# EAGLE design MOTOR_DRIVER (EAGLE 8.0.1)

## Sheet 1 of 4: Motor Driver Schematic
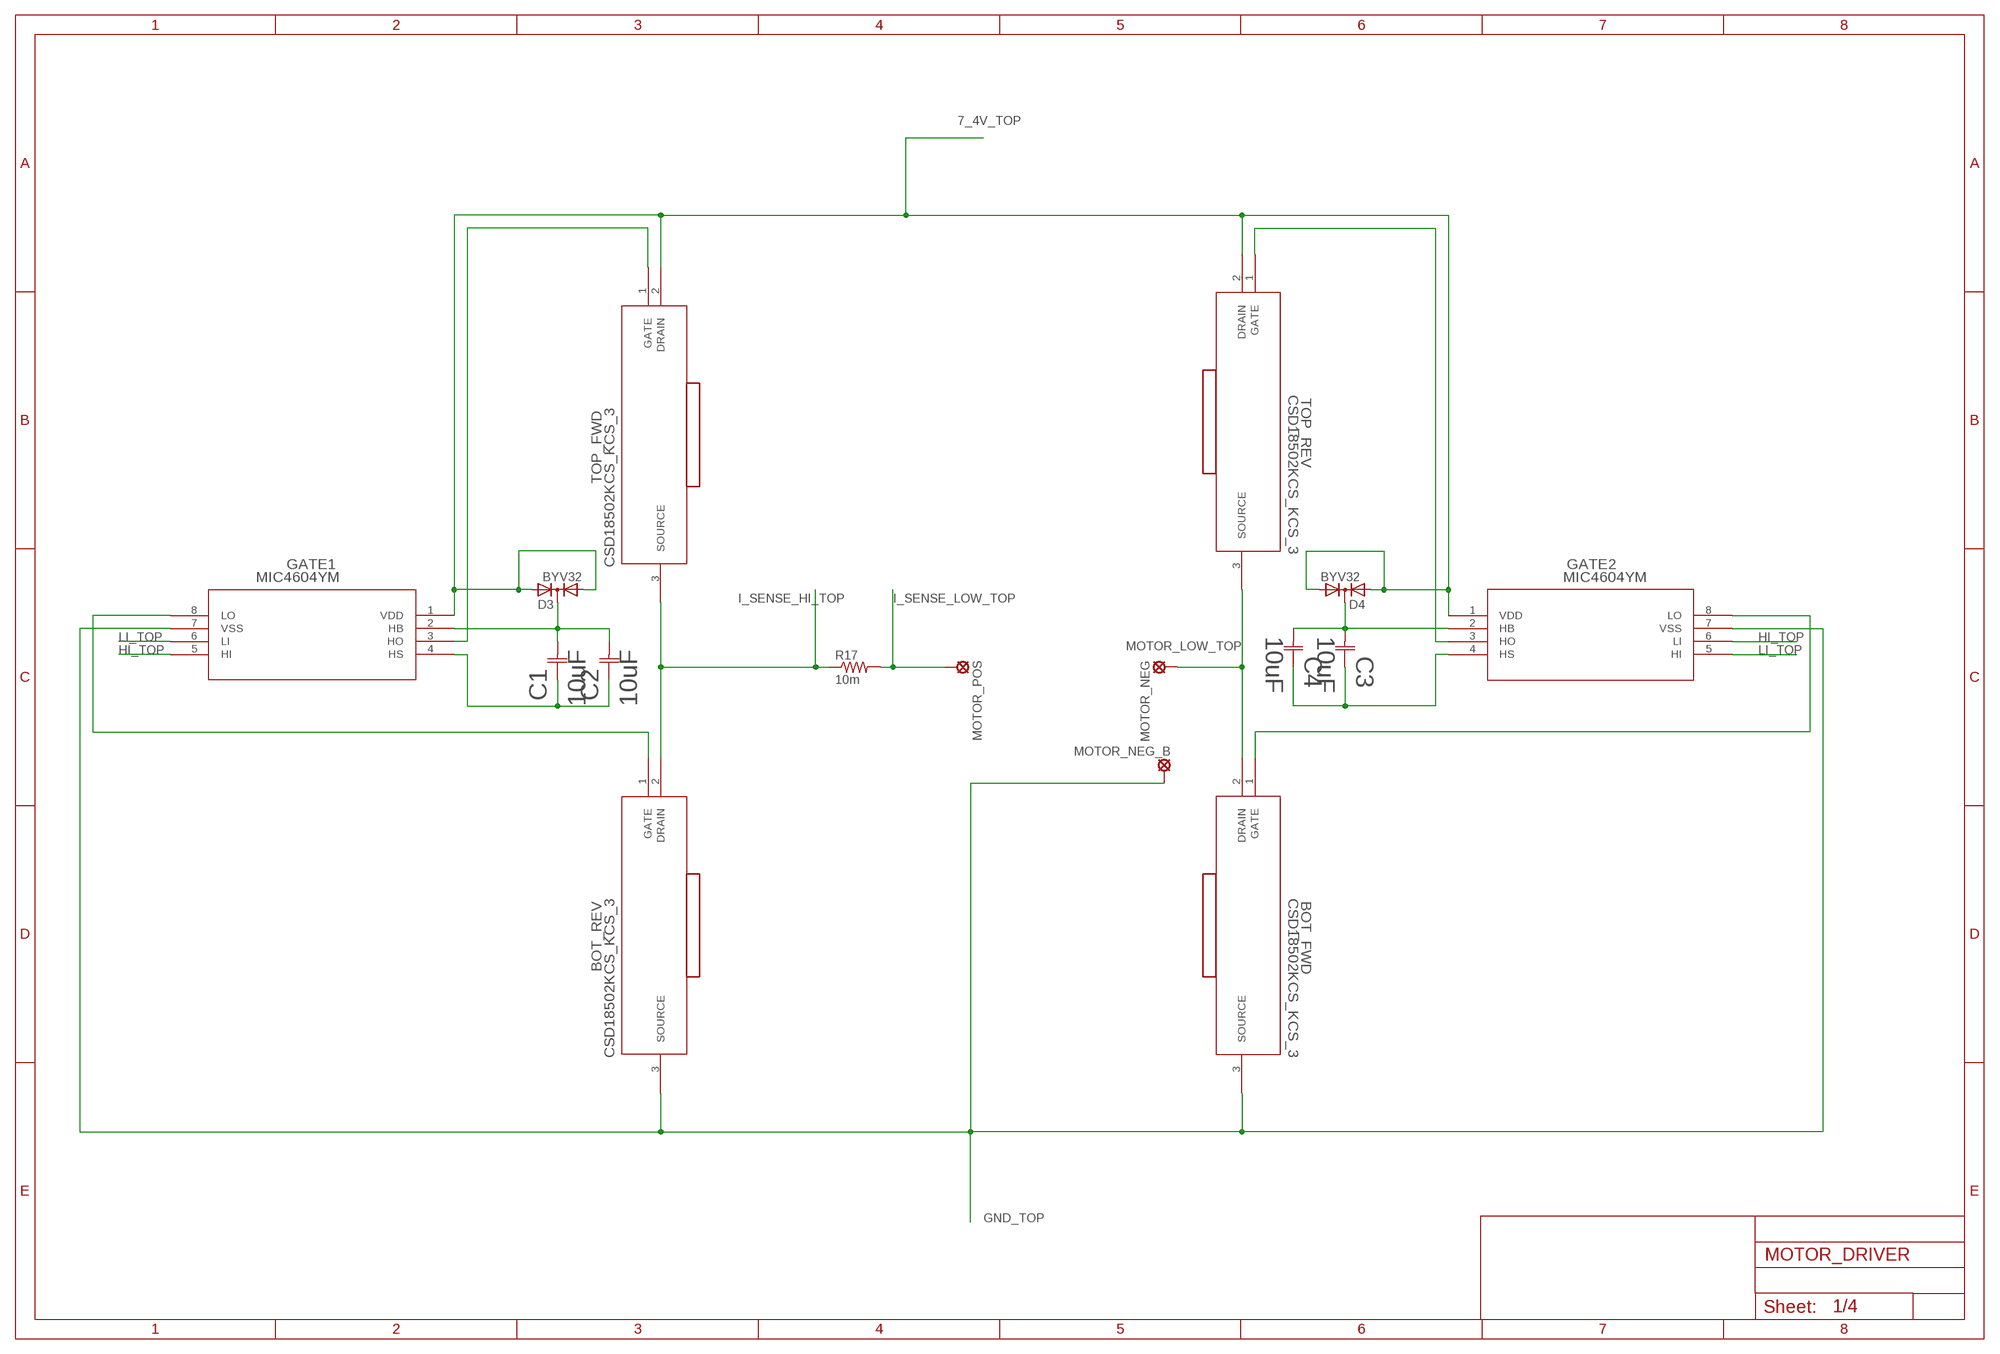
[diagram p0: schematic, sheet 1]

### Parts
BOT_FWD  CSD18502KCS_KCS_3  [KCS3]
BOT_REV  CSD18502KCS_KCS_3  [KCS3]
C1  10uF  EEE1VA100WR  [CAP_EEE_B]
C2  10uF  EEE1VA100WR  [CAP_EEE_B]
C3  10uF  EEE1VA100WR  [CAP_EEE_B]
C4  10uF  EEE1VA100WR  [CAP_EEE_B]
D3  BYV32  [TO220ABS]
D4  BYV32  [TO220ABS]
GATE1  MIC4604YM  [SOIC-8_M]
GATE2  MIC4604YM  [SOIC-8_M]
MOTOR_NEG  SE14  [SE14]
MOTOR_NEG_B  SE14  [SE14]
MOTOR_POS  SE14  [SE14]
R17  10m  R-US_R2512  [R2512]
TOP_FWD  CSD18502KCS_KCS_3  [KCS3]
TOP_REV  CSD18502KCS_KCS_3  [KCS3]
U$2  HEATSINK  [HEATSINK]
U$4  HEATSINK  [HEATSINK]
U$5  HEATSINK  [HEATSINK]
U$6  HEATSINK  [HEATSINK]

### Nets
7_4V_TOP: D3.A1 D3.A2 D4.A1 D4.A2 GATE1.1(VDD) GATE2.1(VDD) TOP_FWD.2(DRAIN) TOP_REV.2(DRAIN) ; also sheet 2,3,4
GND_TOP: BOT_FWD.3(SOURCE) BOT_REV.3(SOURCE) GATE1.7(VSS) GATE2.7(VSS) MOTOR_NEG_B.MP ; also sheet 2,3,4
HI_TOP: GATE1.5(HI) GATE2.6(LI) ; also sheet 3
I_SENSE_HI_TOP: BOT_REV.2(DRAIN) R17.1 TOP_FWD.3(SOURCE) ; also sheet 2
I_SENSE_LOW_TOP: MOTOR_POS.MP R17.2 ; also sheet 2,3
LI_TOP: GATE1.6(LI) GATE2.5(HI) ; also sheet 3
MOTOR_LOW_TOP: BOT_FWD.2(DRAIN) MOTOR_NEG.MP TOP_REV.3(SOURCE) ; also sheet 3
N$2: BOT_REV.1(GATE) GATE1.8(LO)
N$3: GATE1.3(HO) TOP_FWD.1(GATE)
N$4: C1.1 C2.1 GATE1.4(HS)
N$5: C1.2 C2.2 D3.C GATE1.2(HB)
N$9: BOT_FWD.1(GATE) GATE2.8(LO)
N$10: GATE2.3(HO) TOP_REV.1(GATE)
N$11: C3.1 C4.1 GATE2.4(HS)
N$12: C3.2 C4.2 D4.C GATE2.2(HB)

## Sheet 2 of 4: Microcontroller schematic
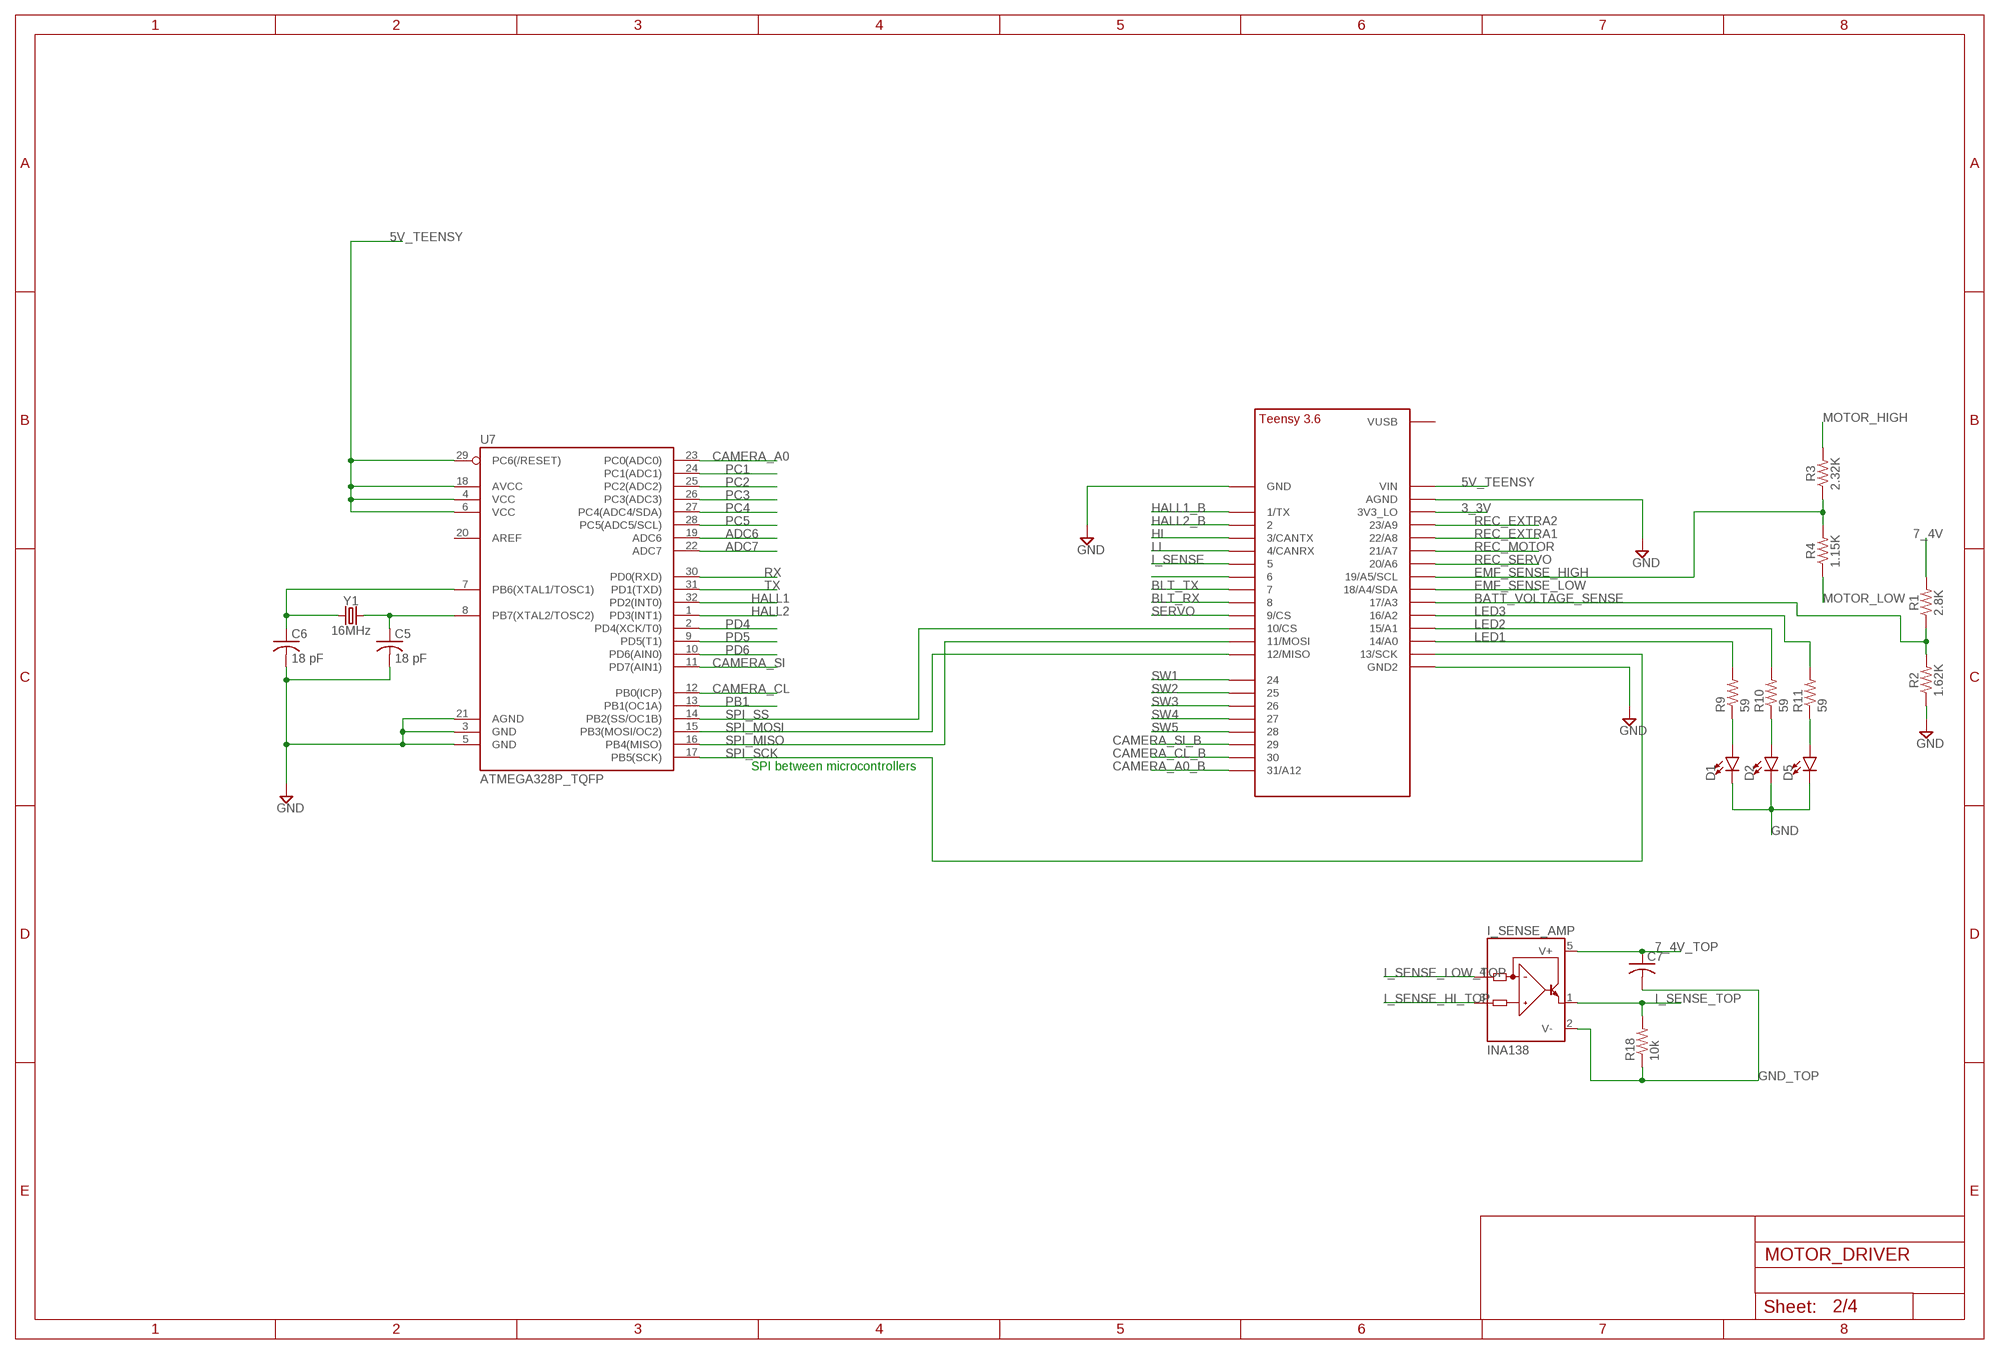
[diagram p1: schematic, sheet 2]

### Parts
C5  18 pF  C-USC0603  [C0603]
C6  18 pF  C-USC0603  [C0603]
C7  C-USC0603  [C0603]
D1  LED0603  [LED-0603]
D2  LED0603  [LED-0603]
D5  LED0603  [LED-0603]
I_SENSE_AMP  INA138  [SOT23-5]
R1  2.8K  0.3OHM-0805-1/8W-1%  [0805]
R2  1.62K  0.3OHM-0805-1/8W-1%  [0805]
R3  2.32K  0.3OHM-0805-1/8W-1%  [0805]
R4  1.15K  0.3OHM-0805-1/8W-1%  [0805]
R9  59  R-US_R0805  [R0805]
R10  59  R-US_R0805  [R0805]
R11  59  R-US_R0805  [R0805]
R18  10k  R-US_R0603  [R0603]
U7  ATMEGA328P_TQFP  [TQFP32-08]
U$1  TEENSY_3.5/3.6_FEWER  [TEENSY_3.5/3.6_BASIC_FEWER_PIN]
Y1  16MHz  CRYSTAL-16MHZPTH-HC49US  [HC49US]

### Nets
3_3V: U$1.3V3_LO ; also sheet 3
5V_TEENSY: U7.4(VCC) U7.6(VCC) U7.18(AVCC) U7.29(PC6(/RESET)) U$1.VIN ; also sheet 3
7_4V: R1.2 ; also sheet 3,4
7_4V_TOP: C7.1 I_SENSE_AMP.5(V+) ; also sheet 1,3,4
ADC6: U7.19(ADC6) ; also sheet 3
ADC7: U7.22(ADC7) ; also sheet 3
BATT_VOLTAGE_SENSE: R1.1 R2.2 U$1.17/A3
BLT_RX: U$1.8 ; also sheet 3
BLT_TX: U$1.7 ; also sheet 3
CAMERA_A0: U7.23(PC0(ADC0)) ; also sheet 3
CAMERA_A0_B: U$1.31/A12 ; also sheet 3
CAMERA_CL: U7.12(PB0(ICP)) ; also sheet 3
CAMERA_CL_B: U$1.30 ; also sheet 3
CAMERA_SI: U7.11(PD7(AIN1)) ; also sheet 3
CAMERA_SI_B: U$1.29 ; also sheet 3
EMF_SENSE_HIGH: R3.1 R4.2 U$1.19/A5/SCL
EMF_SENSE_LOW: U$1.18/A4/SDA ; also sheet 3
GND: C5.2 C6.2 D1.C D2.C D5.C R2.1 U7.3(GND) U7.5(GND) U7.21(AGND) U$1.AGND U$1.GND U$1.GND2 ; also sheet 3,4
GND_TOP: C7.2 I_SENSE_AMP.2(V-) R18.1 ; also sheet 1,3,4
HALL1: U7.32(PD2(INT0)) ; also sheet 3
HALL1_B: U$1.1/TX ; also sheet 3
HALL2: U7.1(PD3(INT1)) ; also sheet 3
HALL2_B: U$1.2 ; also sheet 3
HI: U$1.3/CANTX ; also sheet 3
I_SENSE: U$1.5 ; also sheet 3
I_SENSE_HI_TOP: I_SENSE_AMP.3(IN+) ; also sheet 1
I_SENSE_LOW_TOP: I_SENSE_AMP.4(IN-) ; also sheet 1,3
I_SENSE_TOP: I_SENSE_AMP.1(OUT) R18.2 ; also sheet 3
LED1: R9.2 U$1.14/A0
LED2: R10.2 U$1.15/A1
LED3: R11.2 U$1.16/A2
LI: U$1.4/CANRX ; also sheet 3
LI2: U$1.6
MOTOR_HIGH: R3.2 ; also sheet 3
MOTOR_LOW: R4.1 ; also sheet 3
N$6: C6.1 U7.7(PB6(XTAL1/TOSC1)) Y1.1
N$7: C5.1 U7.8(PB7(XTAL2/TOSC2)) Y1.2
N$22: D1.A R9.1
N$23: D2.A R10.1
N$24: D5.A R11.1
PB1: U7.13(PB1(OC1A)) ; also sheet 3
PC1: U7.24(PC1(ADC1)) ; also sheet 3
PC2: U7.25(PC2(ADC2)) ; also sheet 3
PC3: U7.26(PC3(ADC3)) ; also sheet 3
PC4: U7.27(PC4(ADC4/SDA)) ; also sheet 3
PC5: U7.28(PC5(ADC5/SCL)) ; also sheet 3
PD4: U7.2(PD4(XCK/T0)) ; also sheet 3
PD5: U7.9(PD5(T1)) ; also sheet 3
PD6: U7.10(PD6(AIN0))
REC_EXTRA1: U$1.22/A8 ; also sheet 3
REC_EXTRA2: U$1.23/A9 ; also sheet 3
REC_MOTOR: U$1.21/A7 ; also sheet 3
REC_SERVO: U$1.20/A6 ; also sheet 3
RX: U7.30(PD0(RXD)) ; also sheet 3
SERVO: U$1.9/CS ; also sheet 3
SPI_MISO: U7.16(PB4(MISO)) U$1.11/MOSI
SPI_MOSI: U7.15(PB3(MOSI/OC2)) U$1.12/MISO
SPI_SCK: U7.17(PB5(SCK)) U$1.13/SCK
SPI_SS: U7.14(PB2(SS/OC1B)) U$1.10/CS
SW1: U$1.24 ; also sheet 3
SW2: U$1.25 ; also sheet 3
SW3: U$1.26 ; also sheet 3
SW4: U$1.27 ; also sheet 3
SW5: U$1.28
TX: U7.31(PD1(TXD)) ; also sheet 3
Unconnected: U7.20(AREF) U$1.VUSB

### Notes on the sheet
- SPI between microcontrollers

## Sheet 3 of 4: Header schematic
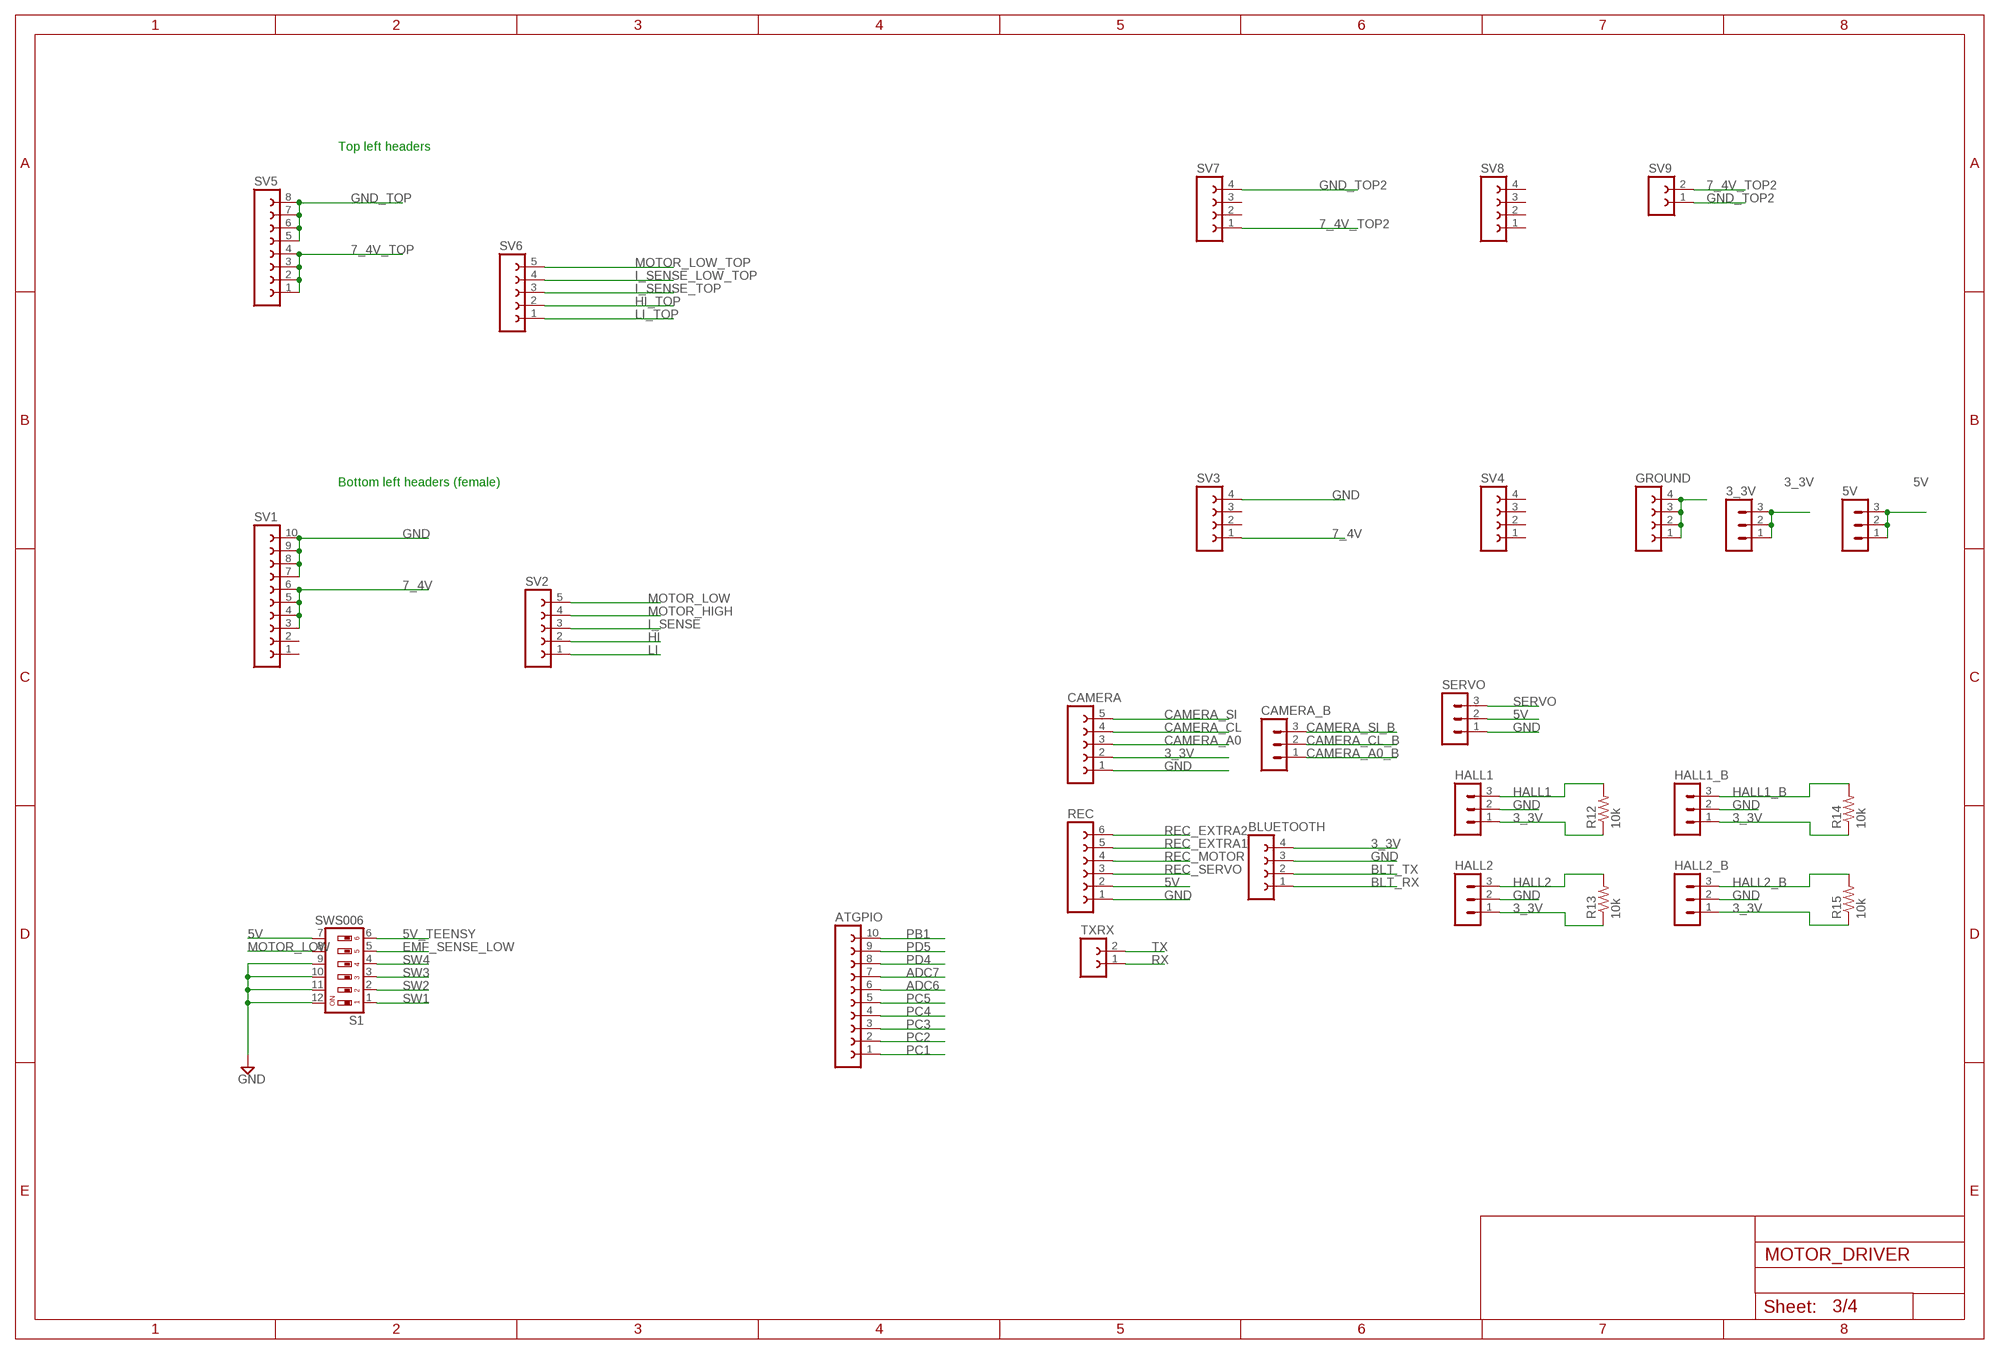
[diagram p2: schematic, sheet 3]

### Parts
3_3V  MA03-1  [MA03-1]
5V  MA03-1  [MA03-1]
ATGPIO  FE10-1  [FE10]
BLUETOOTH  FE04-1  [FE04-1]
CAMERA  FE05-1  [FE05-1]
CAMERA_B  MA03-1  [MA03-1]
GROUND  FE04-1  [FE04-1]
HALL1  MA03-1  [MA03-1]
HALL1_B  MA03-1  [MA03-1]
HALL2  MA03-1  [MA03-1]
HALL2_B  MA03-1  [MA03-1]
R12  10k  R-US_R0603  [R0603]
R13  10k  R-US_R0603  [R0603]
R14  10k  R-US_R0603  [R0603]
R15  10k  R-US_R0603  [R0603]
REC  FE06-1  [FE06]
S1  SWS006  [SMS-006]
SERVO  MA03-1  [MA03-1]
SV1  FE10-1  [FE10]
SV2  FE05-1  [FE05-1]
SV3  FE04-1  [FE04-1]
SV4  FE04-1  [FE04-1]
SV5  FE08-1  [FE08]
SV6  FE05-1  [FE05-1]
SV7  FE04-1  [FE04-1]
SV8  FE04-1  [FE04-1]
SV9  FE02-1  [FE02-1]
TXRX  FE02-1  [FE02-1]

### Nets
3_3V: 3_3V.1 3_3V.2 3_3V.3 BLUETOOTH.4 CAMERA.2 HALL1.1 HALL1_B.1 HALL2.1 HALL2_B.1 R12.1 R13.1 R14.1 R15.1 ; also sheet 2
5V: 5V.1 5V.2 5V.3 REC.2 S1.7 SERVO.2 ; also sheet 4
5V_TEENSY: S1.6 ; also sheet 2
7_4V: SV1.3 SV1.4 SV1.5 SV1.6 SV3.1 ; also sheet 2,4
7_4V_TOP: SV5.1 SV5.2 SV5.3 SV5.4 ; also sheet 1,2,4
7_4V_TOP2: SV7.1 SV9.2 ; also sheet 4
ADC6: ATGPIO.6 ; also sheet 2
ADC7: ATGPIO.7 ; also sheet 2
BLT_RX: BLUETOOTH.1 ; also sheet 2
BLT_TX: BLUETOOTH.2 ; also sheet 2
CAMERA_A0: CAMERA.3 ; also sheet 2
CAMERA_A0_B: CAMERA_B.1 ; also sheet 2
CAMERA_CL: CAMERA.4 ; also sheet 2
CAMERA_CL_B: CAMERA_B.2 ; also sheet 2
CAMERA_SI: CAMERA.5 ; also sheet 2
CAMERA_SI_B: CAMERA_B.3 ; also sheet 2
EMF_SENSE_LOW: S1.5 ; also sheet 2
GND: BLUETOOTH.3 CAMERA.1 GROUND.1 GROUND.2 GROUND.3 GROUND.4 HALL1.2 HALL1_B.2 HALL2.2 HALL2_B.2 REC.1 S1.9 S1.10 S1.11 S1.12 SERVO.1 SV1.7 SV1.8 SV1.9 SV1.10 SV3.4 ; also sheet 2,4
GND_TOP: SV5.5 SV5.6 SV5.7 SV5.8 ; also sheet 1,2,4
GND_TOP2: SV7.4 SV9.1 ; also sheet 4
HALL1: HALL1.3 R12.2 ; also sheet 2
HALL1_B: HALL1_B.3 R14.2 ; also sheet 2
HALL2: HALL2.3 R13.2 ; also sheet 2
HALL2_B: HALL2_B.3 R15.2 ; also sheet 2
HI: SV2.2 ; also sheet 2
HI_TOP: SV6.2 ; also sheet 1
I_SENSE: SV2.3 ; also sheet 2
I_SENSE_LOW_TOP: SV6.4 ; also sheet 1,2
I_SENSE_TOP: SV6.3 ; also sheet 2
LI: SV2.1 ; also sheet 2
LI_TOP: SV6.1 ; also sheet 1
MOTOR_HIGH: SV2.4 ; also sheet 2
MOTOR_LOW: S1.8 SV2.5 ; also sheet 2
MOTOR_LOW_TOP: SV6.5 ; also sheet 1
PB1: ATGPIO.10 ; also sheet 2
PC1: ATGPIO.1 ; also sheet 2
PC2: ATGPIO.2 ; also sheet 2
PC3: ATGPIO.3 ; also sheet 2
PC4: ATGPIO.4 ; also sheet 2
PC5: ATGPIO.5 ; also sheet 2
PD4: ATGPIO.8 ; also sheet 2
PD5: ATGPIO.9 ; also sheet 2
REC_EXTRA1: REC.5 ; also sheet 2
REC_EXTRA2: REC.6 ; also sheet 2
REC_MOTOR: REC.4 ; also sheet 2
REC_SERVO: REC.3 ; also sheet 2
RX: TXRX.1 ; also sheet 2
SERVO: SERVO.3 ; also sheet 2
SW1: S1.1 ; also sheet 2
SW2: S1.2 ; also sheet 2
SW3: S1.3 ; also sheet 2
SW4: S1.4 ; also sheet 2
TX: TXRX.2 ; also sheet 2
Unconnected: SV1.1 SV1.2 SV3.2 SV3.3 SV4.1 SV4.2 SV4.3 SV4.4 SV7.2 SV7.3 SV8.1 SV8.2 SV8.3 SV8.4

### Notes on the sheet
- Top left headers
- Bottom left headers (female)

## Sheet 4 of 4: Power Schematic
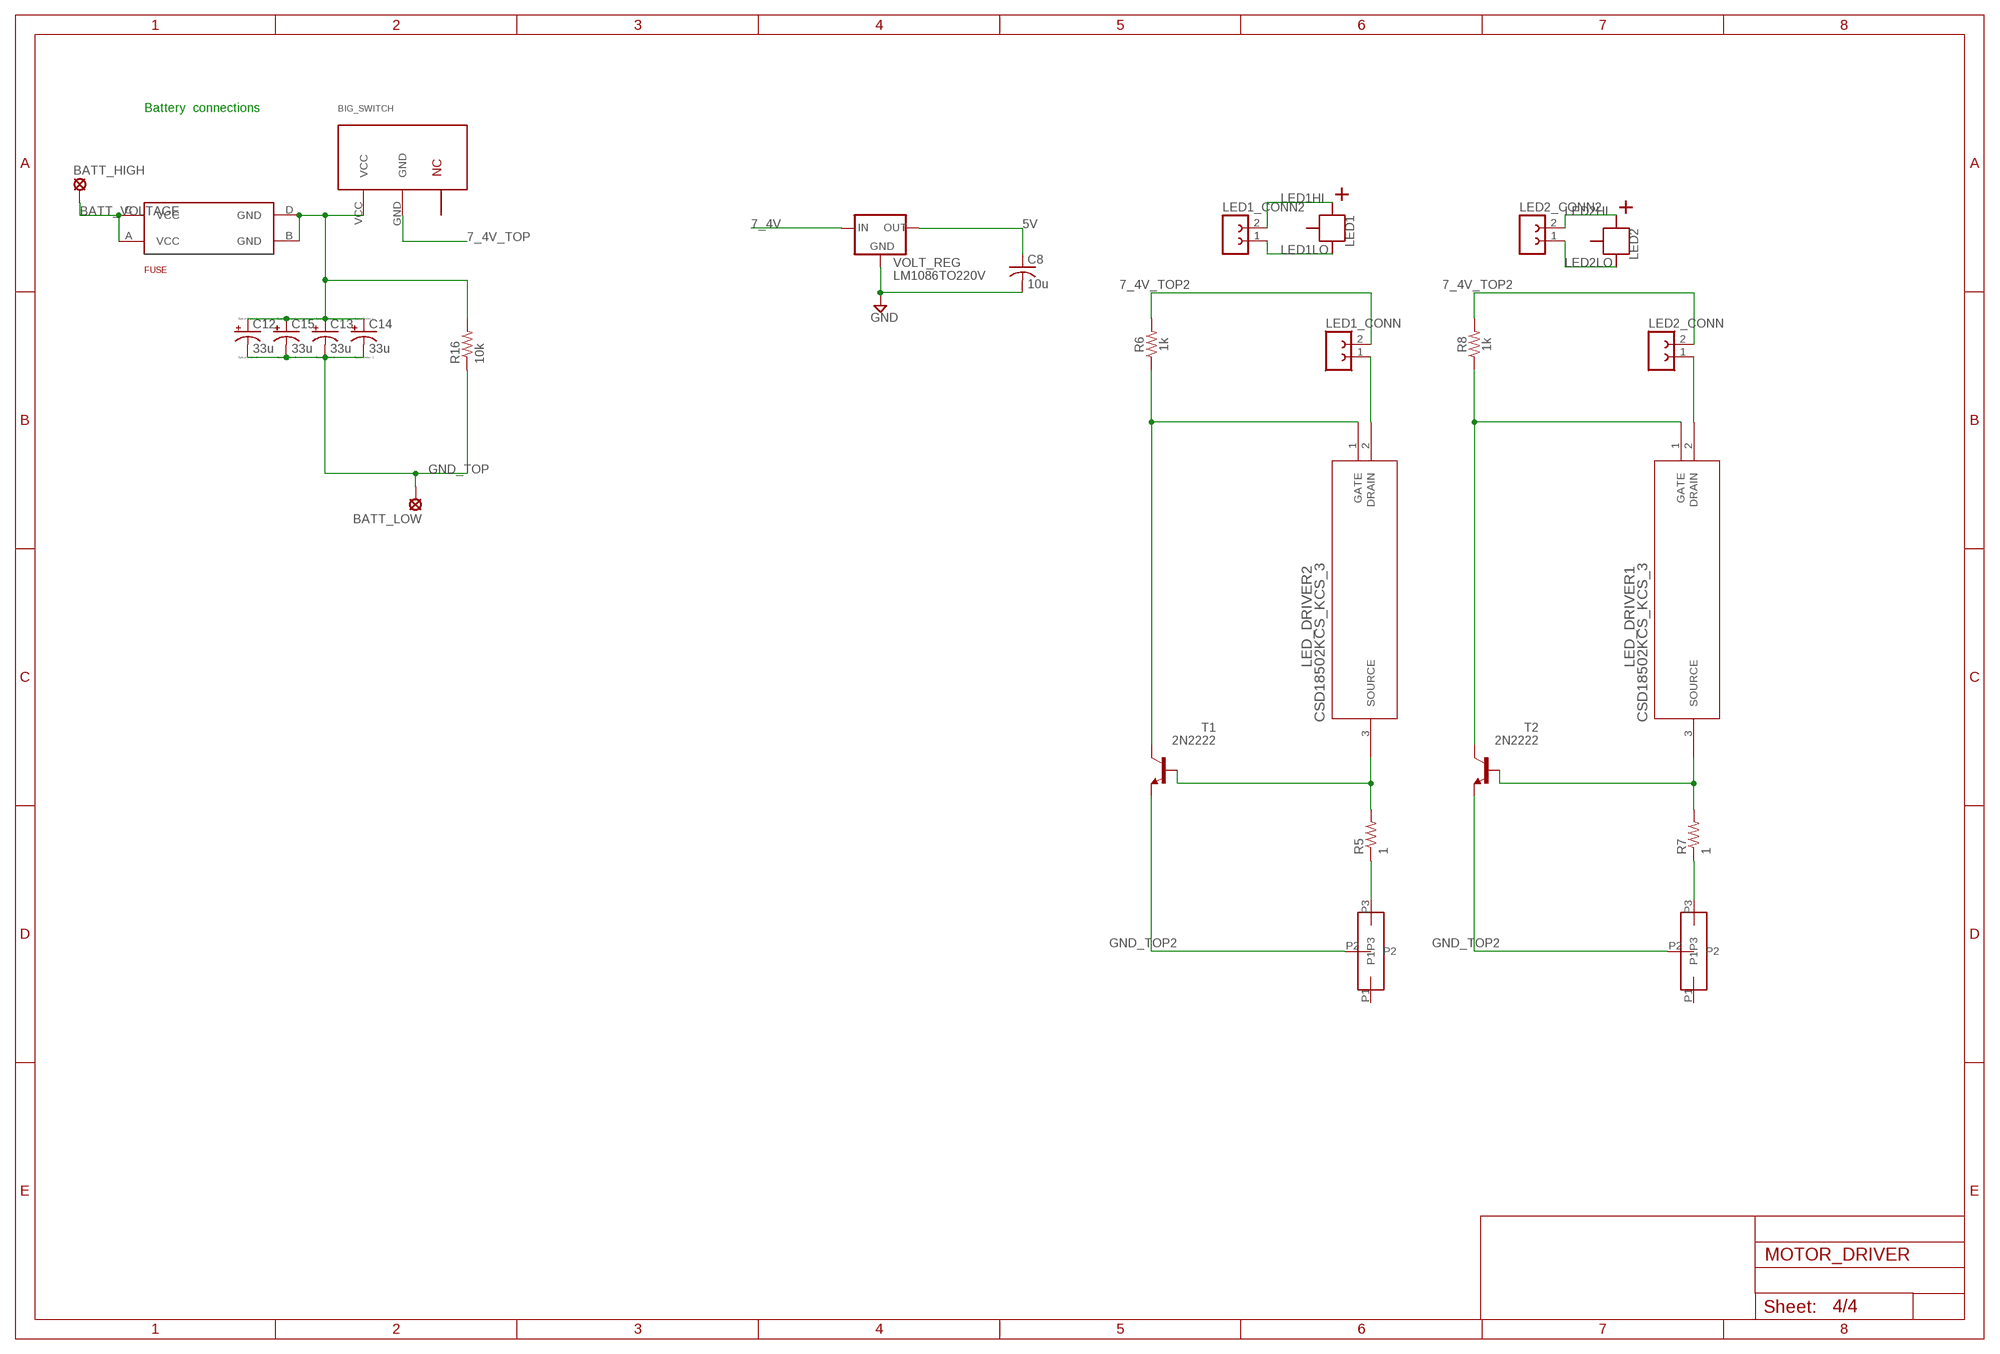
[diagram p3: schematic, sheet 4]

### Parts
BATT_HIGH  SE14  [SE14]
BATT_LOW  SE14  [SE14]
BIG_SWITCH  BIGSWITCH  [BIGSWITCH]
C8  10u  C-USC0805  [C0805]
C12  33u  CPOL-US153CLV-1010  [153CLV-1010]
C13  33u  CPOL-US153CLV-1010  [153CLV-1010]
C14  33u  CPOL-US153CLV-1010  [153CLV-1010]
C15  33u  CPOL-US153CLV-1010  [153CLV-1010]
FUSE  FUSEHOLDER3588  [FUSEHOLDER3588]
LED1  CREE_XP  [XP]
LED1_CONN  FE02-1  [FE02-1]
LED1_CONN2  FE02-1  [FE02-1]
LED2  CREE_XP  [XP]
LED2_CONN  FE02-1  [FE02-1]
LED2_CONN2  FE02-1  [FE02-1]
LED_DRIVER1  CSD18502KCS_KCS_3  [KCS3]
LED_DRIVER2  CSD18502KCS_KCS_3  [KCS3]
R5  1  R-US_R2512  [R2512]
R6  1k  1KOHM-HORIZ-1/4W-1%  [AXIAL-0.3]
R7  1  R-US_R2512  [R2512]
R8  1k  1KOHM-HORIZ-1/4W-1%  [AXIAL-0.3]
R16  10k  R-US_R0603  [R0603]
T1  2N2222  [TO18]
T2  2N2222  [TO18]
U$3  POT  [POT]
U$7  POT  [POT]
VOLT_REG  LM1086TO220V  [TO220S]

### Nets
5V: C8.1 VOLT_REG.2(OUT) ; also sheet 3
7_4V: VOLT_REG.3(IN) ; also sheet 2,3
7_4V_TOP: BIG_SWITCH.GND ; also sheet 1,2,3
7_4V_TOP2: LED1_CONN.2 LED2_CONN.2 R6.P$2 R8.P$2 ; also sheet 3
BATT_VOLTAGE: BATT_HIGH.MP FUSE.A(VCC) FUSE.C(VCC)
GND: C8.2 VOLT_REG.1(GND) ; also sheet 2,3
GND_TOP: BATT_LOW.MP C12.- C13.- C14.- C15.- R16.1 ; also sheet 1,2,3
GND_TOP2: T1.1(E) T2.1(E) U$3.P2 U$7.P2 ; also sheet 3
LED1HI: LED1.POSITIVE LED1.POSITIVE1(POSITIVE) LED1_CONN2.2
LED1LO: LED1.NEGATIVE LED1.NEGATIVE1(NEGATIVE) LED1_CONN2.1
LED2HI: LED2.POSITIVE LED2.POSITIVE1(POSITIVE) LED2_CONN2.2
LED2LO: LED2.NEGATIVE LED2.NEGATIVE1(NEGATIVE) LED2_CONN2.1
N$1: R5.1 U$7.P3
N$8: LED_DRIVER2.3(SOURCE) R5.2 T1.2(B)
N$13: R7.1 U$3.P3
N$16: LED_DRIVER2.1(GATE) R6.P$1 T1.3(C)
N$17: LED1_CONN.1 LED_DRIVER2.2(DRAIN)
N$18: LED_DRIVER1.3(SOURCE) R7.2 T2.2(B)
N$19: LED_DRIVER1.1(GATE) R8.P$1 T2.3(C)
N$20: LED2_CONN.1 LED_DRIVER1.2(DRAIN)
N$21: BIG_SWITCH.VCC C12.+ C13.+ C14.+ C15.+ FUSE.B(GND) FUSE.D(GND) R16.2
Unconnected: LED1.THERMAL LED2.THERMAL U$3.P1 U$7.P1

### Notes on the sheet
- Battery  connections

## Library data of the parts
3_3V 5V = con-lstb:MA03-1: PIN HEADER; OC_FARNELL: unknown; OC_NEWARK: unknown
ATGPIO SV1 = con-lsta:FE10-1: FEMALE HEADER
BATT_HIGH BATT_LOW MOTOR_NEG MOTOR_NEG_B MOTOR_POS = solpad:SE14: SOLDER PAD E1553, drill 1,4mm, distributor Buerklin, 07F820
BIG_SWITCH = bigswitch:BIGSWITCH: Rocker Switch SPST 25A (DC) Panel Mount, Snap-In; DIGIKEY_PART_NUMBER: CW106-ND; MANUFACTURER: CW Industries; MANUFACTURER_PART_NUMBER: GRB238B801BR1; PRICE: $2.86
BLUETOOTH = con-lsta:FE04-1: FEMALE HEADER; MANUFACTURER: HC Information Technology; MANUFACTURER_PART_NUMBER: HC-06
BOT_FWD BOT_REV LED_DRIVER1 LED_DRIVER2 TOP_FWD TOP_REV = CSD18502KCS:CSD18502KCS_KCS_3: MOSFET N-CH 60V 100A TO220-3; DIGIKEY_PART_NUMBER: 296-35013-ND; MANUFACTURER: Texas Instruments; MANUFACTURER_PART_NUMBER: CSD18533KCS; PRICE: $1.53
C1-C4 = cap-aluminum:EEE1VA100WR; MANUFACTURER_PART_NUMBER: EEE1VA100WR; VENDOR: Panasonic
C5 C6 C8 = rcl:C-US: CAPACITOR, American symbol
C7 = resistor:C-US: CAPACITOR, American symbol
C12-C15 = resistor:CPOL-US: POLARIZED CAPACITOR, American symbol
CAMERA = con-lsta:FE05-1: FEMALE HEADER; DIGIKEY_PART_NUMBER: 28317-ND; MANUFACTURER: Parallax; MANUFACTURER_PART_NUMBER: 28317; OC_FARNELL: unknown; OC_NEWARK: unknown; PRICE: $49.99
CAMERA_B = con-lstb:MA03-1: PIN HEADER; DIGIKEY_PART_NUMBER: 28317-ND; MANUFACTURER: Parallax; MANUFACTURER_PART_NUMBER: 28317; OC_FARNELL: unknown; OC_NEWARK: unknown; PRICE: $49.99
D1 D2 D5 = SparkFun-LED:LED: LED (Generic) Standard schematic elements and footprints for 5mm, 3mm, 1206, and 0603 sized LEDs. Generic LEDs with no color specified.
D3 D4 = diode:BYV32: DIODE 2 x Si diode 200 V, 20 A/230 Apeak, 25 ns
FUSE = minifuse:FUSEHOLDER3588: Fuseholder for Keystone 3588 mini fuse; DIGIKEY_PART_NUMBER: F4989-ND; MANUFACTURER: Littelfuse Inc.; MANUFACTURER_PART_NUMBER: 0891010.NXS; PRICE: $0.37
GATE1 GATE2 = MIC4604:MIC4604YM: IC DRIVER MOSFET 85V 8-SOIC; DIGIKEY_PART_NUMBER: 576-4395-1-ND; MANUFACTURER: Microchip; MANUFACTURER_PART_NUMBER: MIC4604YM-T5; PRICE: $1.25
GROUND SV3 SV4 SV7 SV8 = con-lsta:FE04-1: FEMALE HEADER
HALL1 HALL1_B HALL2 HALL2_B = con-lstb:MA03-1: PIN HEADER; DIGIKEY_PART_NUMBER: US1881LUA-AAA-000-BU-ND; MANUFACTURER: Melexis Technologies NV; MANUFACTURER_PART_NUMBER: US1881LUA-AAA-000-BU; OC_FARNELL: unknown; OC_NEWARK: unknown; PRICE: $0.95
I_SENSE_AMP = burr-brown:INA138: High-Side Measurement Current Shunt Monitor; DIGIKEY_PART_NUMBER: INA138NACT-ND; MANUFACTURER: Texas Instruments; MANUFACTURER_PART_NUMBER: INA138NA/250
LED1 LED2 = Cree_XP:CREE_XP
LED1_CONN LED1_CONN2 LED2_CONN LED2_CONN2 SV9 TXRX = con-lsta:FE02-1: FEMALE HEADER
R1 = SparkFun-Resistors:0.3OHM: 0.3O resistor A resistor is a passive two-terminal electrical component that implements electrical resistance as a circuit element. Resistors act to reduce current flow, and, at the same time, act to lower voltage levels within circuits. - Wikipedia; DIGIKEY_PART_NUMBER: 311-2.80KCRCT-ND; MANUFACTURER: Yageo; MANUFACTURER_PART_NUMBER: RC0805FR-072K8L; PRICE: $0.10; VALUE: 0.3
R2 = SparkFun-Resistors:0.3OHM: 0.3O resistor A resistor is a passive two-terminal electrical component that implements electrical resistance as a circuit element. Resistors act to reduce current flow, and, at the same time, act to lower voltage levels within circuits. - Wikipedia; DIGIKEY_PART_NUMBER: 311-1.62KCRCT-ND; MANUFACTURER: Yageo; MANUFACTURER_PART_NUMBER: RC0805FR-071K62L; PRICE: $0.10; VALUE: 0.3
R3 = SparkFun-Resistors:0.3OHM: 0.3O resistor A resistor is a passive two-terminal electrical component that implements electrical resistance as a circuit element. Resistors act to reduce current flow, and, at the same time, act to lower voltage levels within circuits. - Wikipedia; DIGIKEY_PART_NUMBER: 311-2.32KCRCT-ND; MANUFACTURER: Yageo; MANUFACTURER_PART_NUMBER: RC0805FR-072K32L; PRICE: $0.10; VALUE: 0.3
R4 = SparkFun-Resistors:0.3OHM: 0.3O resistor A resistor is a passive two-terminal electrical component that implements electrical resistance as a circuit element. Resistors act to reduce current flow, and, at the same time, act to lower voltage levels within circuits. - Wikipedia; DIGIKEY_PART_NUMBER: 311-1.15KCRCT-ND; MANUFACTURER: Yageo; MANUFACTURER_PART_NUMBER: RC0805FR-071K15L; PRICE: $0.10; VALUE: 0.3
R5 R7 R9-R11 R17 R18 = rcl:R-US_: RESISTOR, American symbol
R6 R8 = SparkFun-Resistors:1KOHM: 1kO resistor A resistor is a passive two-terminal electrical component that implements electrical resistance as a circuit element. Resistors act to reduce current flow, and, at the same time, act to lower voltage levels within circuits. - Wikipedia; PROD_ID: RES-12182
R12-R16 = resistor:R-US_: RESISTOR, American symbol
REC = con-lsta:FE06-1: FEMALE HEADER; OC_FARNELL: unknown; OC_NEWARK: unknown
S1 = smd-special:SWS006: SMD Dip Switch 6 pol.; DIGIKEY_PART_NUMBER: CT2196MST-ND; MANUFACTURER: CTS Electrocomponents; MANUFACTURER_PART_NUMBER: 219-6MST; PRICE: $0.91
SERVO = con-lstb:MA03-1: PIN HEADER; MANUFACTURER: TrackStar; MANUFACTURER_PART_NUMBER: TS-P12S; OC_FARNELL: unknown; OC_NEWARK: unknown; PRICE: $18.41
SV2 SV6 = con-lsta:FE05-1: FEMALE HEADER; OC_FARNELL: unknown; OC_NEWARK: unknown
SV5 = con-lsta:FE08-1: FEMALE HEADER; OC_FARNELL: unknown; OC_NEWARK: unknown
T1 T2 = transistor:2N2222: NPN TRANSISTOR
U7 = SparkFun-IC-Microcontroller:ATMEGA328P_TQFP: Popular 328P in QFP Storefront component: ATmega328 - TQFP <https://www.sparkfun.com/products/13448> (COM-13448) Datasheet <http://www.sparkfun.com/datasheets/Components/SMD/ATMega328.pdf> SparkFun Products SparkFun RedBoard - Programmed with Arduino <https://www.sparkfun.com/products/12757> (DEV-12757) Arduino Pro Mini 328 - 5V/16MHz <https://www.sparkfun.com/products/11113> (DEV-11113) Arduino Pro Mini 328 - 3.3V/8MHz <https://www.sparkfun.com/products/11114> (DEV-11114) SparkFun OpenLog <https://www.sparkfun.com/products/13712> (DEV-13712) SparkFun MicroView - OLED Arduino Module <https://www.sparkfun.com/products/12923> (DEV-12923) SparkFun Digital Sandbox <https://www.sparkfun.com/products/12651> (DEV-12651) SparkFun PicoBoard <https://www.sparkfun.com/products/11888> (WIG-11888) Arduino Fio <https://www.sparkfun.com/products/10116> (DEV-10116) LilyPad Arduino 328 Main Board <https://www.sparkfun.com/products/13342> (DEV-13342) SparkFun RedStick <https://www.sparkfun.com/products/13741> (DEV-13741) LilyPad MP3 <https://www.sparkfun.com/products/11013> (DEV-11013) LilyPad Arduino SimpleSnap <https://www.sparkfun.com/products/10941> (DEV-10941) SparkFun Stepoko <https://www.sparkfun.com/products/13899> (ROB-13899) SparkFun Geiger Counter <https://www.sparkfun.com/products/11345> (SEN-11345) SparkFun EL Sequencer <https://www.sparkfun.com/products/12781> (COM-12781) Arduino Pro 328 - 5V/16MHz <https://www.sparkfun.com/products/10915> (DEV-10915) CryptoCape <https://www.sparkfun.com/products/12773> (DEV-12773) SparkFun IR Thermometer Evaluation Board - MLX90614 <https://www.sparkfun.com/products/10740> (SEN-10740) SparkFun RedBot Mainboard <https://www.sparkfun.com/products/12097> (ROB-12097) Arduino Pro 328 - 3.3V/8MHz <https://www.sparkfun.com/products/10914> (DEV-10914) SparkFun Block for Intel® Edison - Arduino <https://www.sparkfun.com/products/13036> (DEV-13036) SparkFun Simon Says - Surface Mount Soldering Kit <https://www.sparkfun.com/products/10935> (KIT-10935) SparkFun 7-Segment Serial Display - Red <https://www.sparkfun.com/products/11441> (COM-11441) SparkFun 7-Segment Serial Display - White <https://www.sparkfun.com/products/11629> (COM-11629) SparkFun 7-Segment Serial Display - Yellow <https://www.sparkfun.com/products/11443> (COM-11443) SparkFun 7-Segment Serial Display - Kelly Green <https://www.sparkfun.com/products/11440> (COM-11440) SparkFun 7-Segment Serial Display - Blue <https://www.sparkfun.com/products/11442> (COM-11442) SparkFun OpenSegment Serial Display - 20mm (Blue) <https://www.sparkfun.com/products/11647> (COM-11647) SparkFun OpenSegment Serial Display - 20mm (Green) <https://www.sparkfun.com/products/11646> (COM-11646) SparkFun OpenSegment Serial Display - 20mm (White) <https://www.sparkfun.com/products/11648> (COM-11648) SparkFun OpenSegment Serial Display - 20mm (Red) <https://www.sparkfun.com/products/11644> (COM-11644) SparkFun OpenSegment Serial Display - 20mm (Yellow) <https://www.sparkfun.com/products/11645> (COM-11645) SparkFun OpenSegment Shield <https://www.sparkfun.com/products/13190> (DEV-13190); DIGIKEY_PART_NUMBER: ATMEGA328PB-AU-ND; MANUFACTURER: Microchip Technology; MANUFACTURER_PART_NUMBER: ATMEGA328PB-AU; PRICE: $1.38
U$1 = Teensy356:TEENSY_3.5/3.6_FEWER; DIGIKEY_PART_NUMBER: 1568-1443-ND; MANUFACTURER: SparkFun Electronics; MANUFACTURER_PART_NUMBER: DEV-14055; PRICE: $26.25
U$2 U$4-U$6 = heatsink:HEATSINK; DIGIKEY_PART_NUMBER: HS112-ND; MANUFACTURER: Aavid Thermalloy; MANUFACTURER_PART_NUMBER: 507002B00000G; PRICE: $0.26
U$3 U$7 = ledpot:POT
VOLT_REG = v-reg-3:LM1086; DIGIKEY_PART_NUMBER: LM1086IT-5.0/NOPB-ND; MANUFACTURER: Texas Instruments; MANUFACTURER_PART_NUMBER: LM1086IT-5.0/NOPB; PRICE: $1.67
Y1 = SparkFun-Clocks:CRYSTAL-16MHZ: 16MHz Crystal Digikey Example <http://www.digikey.com/product-search/en?keywords=535-9122-1-ND> Frequency: 16MHz Frequency Stability: ±50ppm Frequency Tolerance: ±20ppm Load Capacitance: 18pF SparkFun Products: Pro Micro -5V/16MHz <https://www.sparkfun.com/products/12640> SparkFun Serial Enabled LCD Kit <https://www.sparkfun.com/products/10097>; DIGIKEY_PART_NUMBER: 887-2425-1-ND; MANUFACTURER: TXC CORPORATION; MANUFACTURER_PART_NUMBER: 9C-16.000MBBK-T; PRICE: $0.36

## Net classes
0 default: width 0.152 mm, drill 0.381 mm, clearance 0.152 mm

## Board
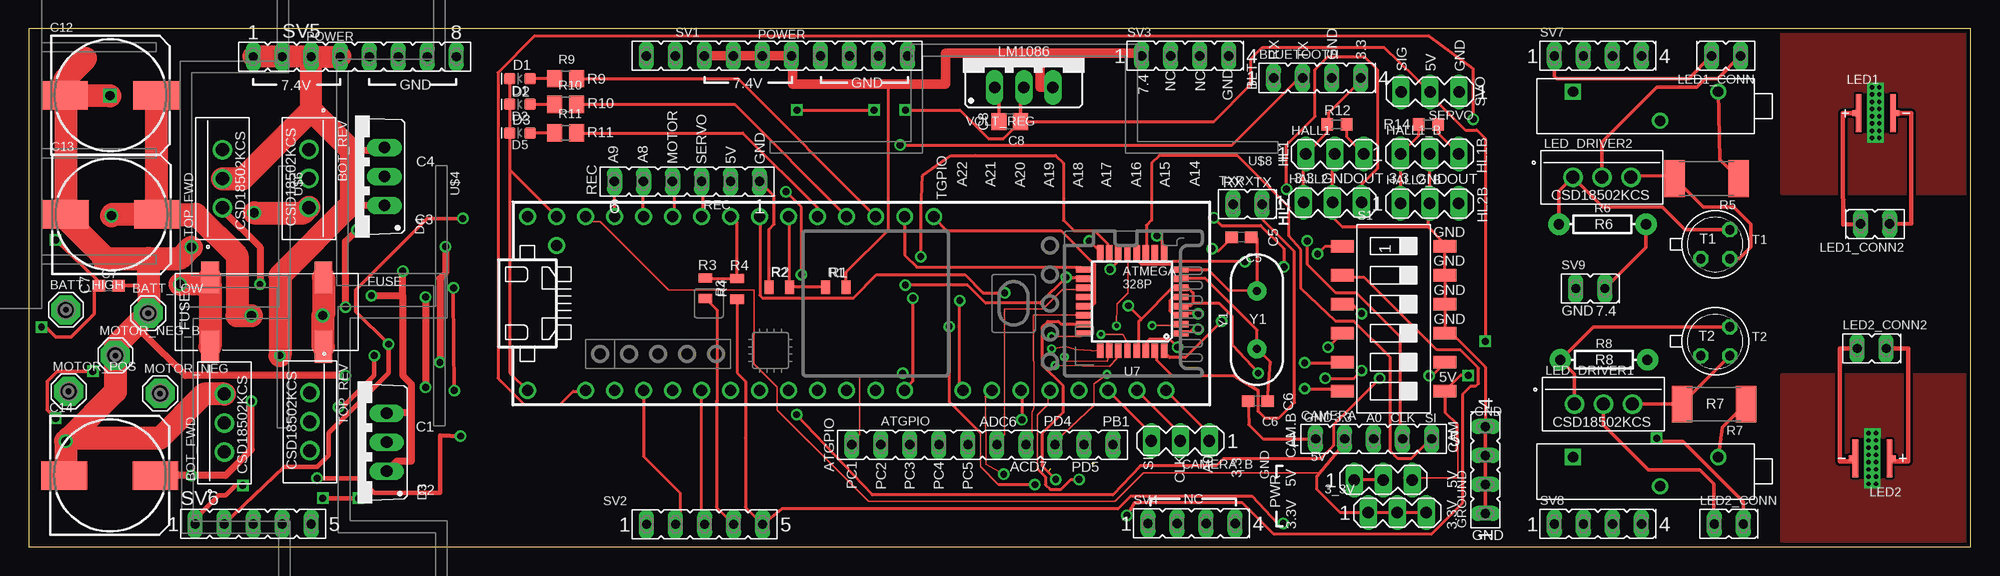
[diagram p4: board, top side]
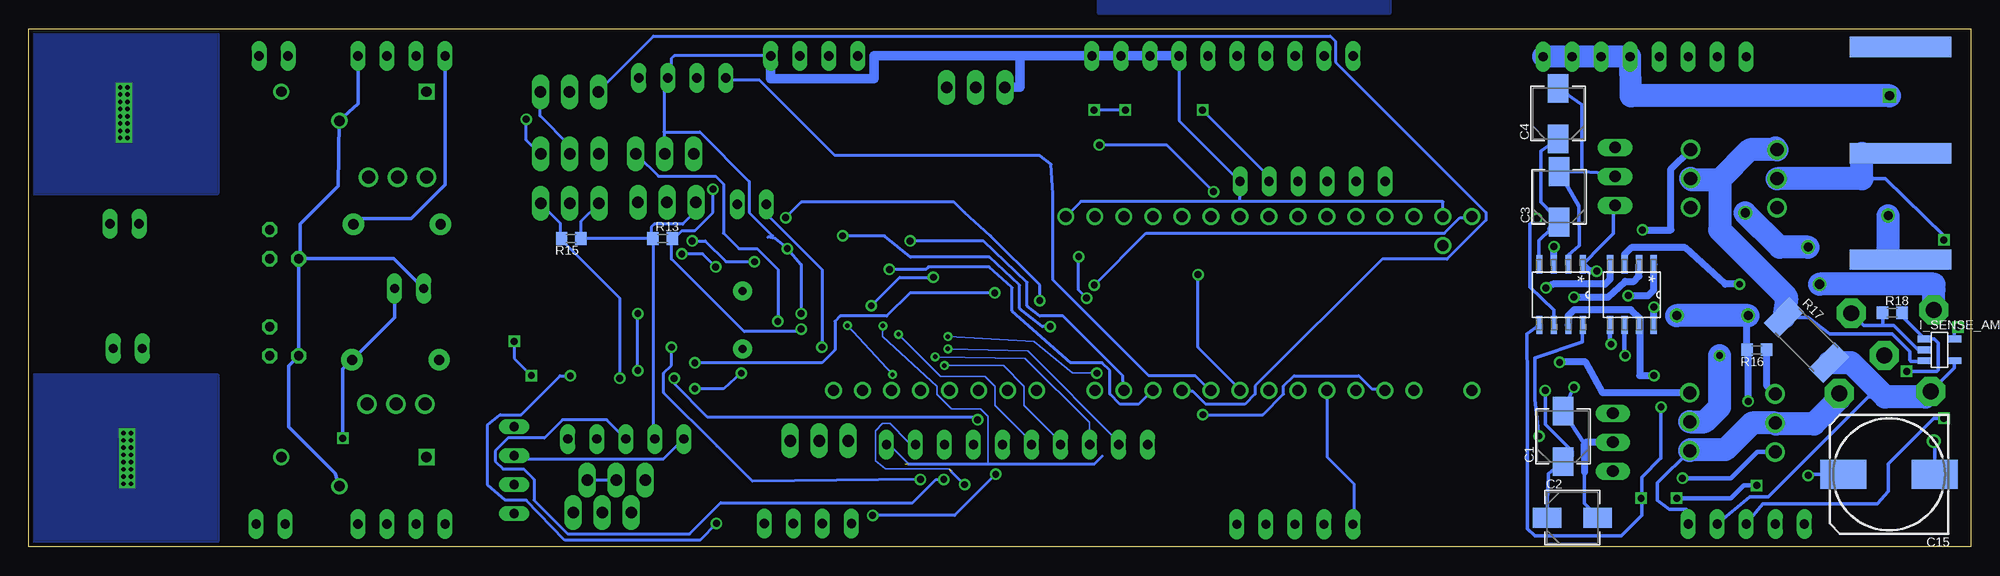
[diagram p5: board, bottom side, seen from below]

Size 170 x 45.39 mm. Coordinates in mm from the lower left corner, seen from the top.
Outline: 0,0 170,0 170,45.39 0,45.39 0,0
Copper layers (1*16): Top 0.035559375mm / dielectric 1.501140625mm / Bottom 0.035559375mm
Design rules "typical_4pcb *": minimum track width 6mil, minimum drill 15mil, track to track 8mil, track to pad 8mil, pad to pad 8mil, via to via 8mil, smd to smd 6mil, copper to edge 15mil, drill to drill 8mil, minimum pad ring 10mil, minimum via ring 8mil, stop-mask expansion 4mil, vias tented up to drill 0mil, thermal gap 10mil

### Footprints (pad centres in the part's own frame; a part is rotated, then mirrored left to right if it is on the bottom)
MA03-1 = drill 1.016 long: 1 -2.54,0; 2 0,0; 3 2.54,0
FE10 = drill 0.813 long: 1 -11.43,0; 2 -8.89,0; 3 -6.35,0; 4 -3.81,0; 5 -1.27,0; 6 1.27,0; 7 3.81,0; 8 6.35,0; 9 8.89,0; 10 11.43,0
SE14 = drill 1.397 pad 2.54 octagon: MP 0,0
BIGSWITCH = smd 1.778 x 8.89 bottom: GND 4.65,0; NC 13.97,0; VCC -4.65,0
FE04-1 = drill 0.813 long: 1 -5.08,0; 2 -2.54,0; 3 0,0; 4 2.54,0
KCS3 = drill 1.143 pad 1.651: 1 -5.08,0; 2 -2.54,0; 3 0,0
CAP_EEE_B = smd 2.515 x 1.778: 1 -2.21,0; 2 2.21,0
C0603 = smd 1.1 x 1: 1 -0.85,0; 2 0.85,0
C0805 = smd 1.3 x 1.5: 1 -0.95,0; 2 0.95,0
153CLV-1010 = smd 4 x 2.5: + 4,0; - -4,0
FE05-1 = drill 0.813 long: 1 -5.08,0; 2 -2.54,0; 3 0,0; 4 2.54,0; 5 5.08,0
LED-0603 = smd 1 x 1: A -0.877,0; C 0.877,0
TO220ABS = drill 1.016 long: A1 -2.54,-2.54; A2 2.54,-2.54; C 0,-2.54
FUSEHOLDER3588 = smd 1.57 x 2.82: A -4.96,3.03; B 4.96,3.03; C -4.96,-3.03; D 4.96,-3.03
SOIC-8_M = smd 1.6 x 0.533: 1 -2.654,1.905; 2 -2.654,0.635; 3 -2.654,-0.635; 4 -2.654,-1.905; 5 2.654,-1.905; 6 2.654,-0.635; 7 2.654,0.635; 8 2.654,1.905
SOT23-5 = smd 0.6 x 1.2: 1 -0.95,-1.306; 2 0,-1.306; 3 0.95,-1.306; 4 0.95,1.306; 5 -0.95,1.306
XP = smd 0.5 x 3.3: NEGATIVE 1.5,0; POSITIVE -1.5,0 | smd 0.4 x 0.5: NEGATIVE1 1.85,0; POSITIVE1 -1.85,0 | smd 1.3 x 3.3: THERMAL 0,0
FE02-1 = drill 0.813 long: 1 -5.08,0; 2 -2.54,0
0805 = smd 0.8 x 1.2: 1 -0.9,0; 2 0.9,0
R2512 = smd 1.8 x 3.2: 1 -2.8,0; 2 2.8,0
AXIAL-0.3 = drill 0.9 pad 1.88: P$1 -3.81,0; P$2 3.81,0
R0805 = smd 1.3 x 1.5: 1 -0.95,0; 2 0.95,0
R0603 = smd 1 x 1.1: 1 -0.85,0; 2 0.85,0
FE06 = drill 0.813 long: 1 -6.35,0; 2 -3.81,0; 3 -1.27,0; 4 1.27,0; 5 3.81,0; 6 6.35,0
SMS-006 = smd 1.092 x 2.007: 1 -6.35,-4.496; 2 -3.81,-4.496; 3 -1.27,-4.496; 4 1.27,-4.496; 5 3.81,-4.496; 6 6.35,-4.496; 7 6.35,4.496; 8 3.81,4.496; 9 1.27,4.496; 10 -1.27,4.496; 11 -3.81,4.496; 12 -6.35,4.496
FE08 = drill 0.813 long: 1 -8.89,0; 2 -6.35,0; 3 -3.81,0; 4 -1.27,0; 5 1.27,0; 6 3.81,0; 7 6.35,0; 8 8.89,0
TO18 = drill 0.813 octagon: 1 -1.27,-1.27; 2 1.27,-1.27; 3 1.27,1.27
TQFP32-08 = smd 1.27 x 0.559: 1 -4.293,2.8; 2 -4.293,2; 3 -4.293,1.2; 4 -4.293,0.4; 5 -4.293,-0.4; 6 -4.293,-1.2; 7 -4.293,-2; 8 -4.293,-2.8; 17 4.293,-2.8; 18 4.293,-2; 19 4.293,-1.2; 20 4.293,-0.4; 21 4.293,0.4; 22 4.293,1.2; 23 4.293,2; 24 4.293,2.8 | smd 0.559 x 1.27: 9 -2.8,-4.293; 10 -2,-4.293; 11 -1.2,-4.293; 12 -0.4,-4.293; 13 0.4,-4.293; 14 1.2,-4.293; 15 2,-4.293; 16 2.8,-4.293; 25 2.8,4.293; 26 2,4.293; 27 1.2,4.293; 28 0.4,4.293; 29 -0.4,4.293; 30 -1.2,4.293; 31 -2,4.293; 32 -2.8,4.293
TEENSY_3.5/3.6_BASIC_FEWER_PIN = drill 0.965: 1/TX -22.86,-7.62; 2 -20.32,-7.62; 3/CANTX -17.78,-7.62; 3V3_LO -22.86,7.62; 4/CANRX -15.24,-7.62; 5 -12.7,-7.62; 6 -10.16,-7.62; 7 -7.62,-7.62; 8 -5.08,-7.62; 9/CS -2.54,-7.62; 10/CS 0,-7.62; 11/MOSI 2.54,-7.62; 12/MISO 5.08,-7.62; 13/SCK 5.08,7.62; 14/A0 2.54,7.62; 15/A1 0,7.62; 16/A2 -2.54,7.62; 17/A3 -5.08,7.62; 18/A4/SDA -7.62,7.62; 19/A5/SCL -10.16,7.62; 20/A6 -12.7,7.62; 21/A7 -15.24,7.62; 22/A8 -17.78,7.62; 23/A9 -20.32,7.62; 24 10.16,-7.62; 25 12.7,-7.62; 26 15.24,-7.62; 27 17.78,-7.62; 28 20.32,-7.62; 29 22.86,-7.62; 30 25.4,-7.62; 31/A12 27.94,-7.62; AGND -25.4,7.62; GND -27.94,-7.62; GND2 7.62,7.62; VIN -27.94,7.62; VUSB -25.4,5.08
POT = drill 0.9 square: P1 1.145,3.175 | drill 0.9: P2 3.685,10.795; P3 1.145,15.875
TO220S = drill 1.016 long: 1 -2.54,-2.54; 2 0,-2.54; 3 2.54,-2.54
HC49US = drill 0.7 pad 1.651: 1 -2.54,0; 2 2.54,0

### Placement (x,y rotation side)
3_3V  119.79,3 0 top
5V  118.57,5.85 0 top
ATGPIO  83.49,8.95 0 top
BATT_HIGH  3.27,20.76 0 top
BATT_LOW  10.47,20.46 0 top
BIG_SWITCH  6.16,29.81 90 top
BLUETOOTH  114.05,41.07 0 top
BOT_FWD  17.14,13.39 90 top
BOT_REV  24.54,29.72 270 top
C1  35.71,9.67 90 bottom
C2  34.89,2.55 0 bottom
C3  36.05,30.65 90 bottom
C4  36.12,37.94 90 bottom
C5  106.14,27.11 180 top
C6  107.58,12.77 180 top
C7  7,22.88 0 top
C8  85.88,37.25 180 top
C12  7.17,39.55 0 top
C13  7.26,29.11 0 top
C14  7.12,6.25 0 top
C15  7.17,6.35 180 bottom
CAMERA  117.72,9.45 0 top
CAMERA_B  100.81,9.29 180 top
D1  43,41 180 top
D2  43,38.75 180 top
D3  28.8,9.16 90 top
D4  28.6,32.44 90 top
D5  43,36.25 180 top
FUSE  20.85,20.57 0 top
GATE1  29.68,22.08 270 bottom
GATE2  35.88,22.08 270 bottom
GROUND  127.5,8 90 top
HALL1  114.33,34.4 0 top
HALL1_B  122.63,34.42 0 top
HALL2  114.13,30.16 0 top
HALL2_B  122.63,30.08 0 top
I_SENSE_AMP  2.75,17.25 270 bottom
LED1  161.67,37.98 0 top
LED1_CONN  144.75,43 180 top
LED1_CONN2  157.8,28.28 180 top
LED2  161.38,7.75 180 top
LED2_CONN  152.62,2 0 top
LED2_CONN2  165.12,17.38 0 top
LED_DRIVER1  140.38,12.5 0 top
LED_DRIVER2  140.25,32.38 0 top
MOTOR_NEG  11.51,13.43 0 top
MOTOR_NEG_B  7.6,16.75 0 top
MOTOR_POS  3.51,13.61 0 top
R1  70.66,22.74 0 top
R2  65.7,22.74 0 top
R3  59.24,22.65 270 top
R4  62.01,22.59 90 top
R5  146.88,32.25 180 top
R6  137.75,28.25 0 top
R7  147.5,12.5 180 top
R8  137.88,16.38 0 top
R9  47,41 0 top
R10  47,38.75 0 top
R11  47,36.25 0 top
R12  114.5,37 0 top
R13  114.5,27 0 bottom
R14  122.5,37 0 top
R15  122.5,27 180 bottom
R16  18.75,17.25 180 bottom
R17  14.39,18.11 315 bottom
R18  6.88,20.5 0 bottom
REC  57.62,32 180 top
S1  119.48,19.99 270 top
SERVO  122.66,39.85 180 top
SV1  65.5,43 0 top
SV2  59.17,1.97 0 top
SV3  102.5,43 0 top
SV4  103.06,2.05 0 top
SV5  28.55,42.93 0 top
SV6  19.66,2.01 0 top
SV7  138.62,43 0 top
SV8  138.62,2 0 top
SV9  140.5,22.62 0 top
T1  147.62,26.5 0 top
T2  147.62,18 0 top
TOP_FWD  16.97,34.78 90 top
TOP_REV  24.61,8.41 270 top
TXRX  110.5,30 0 top
U7  96.58,21.48 180 top
U$1  71.6,21.32 0 top
U$2  26.95,32.81 270 top
U$3  132,9 270 top
U$4  27.12,11.16 270 top
U$5  13.25,32.64 270 top
U$6  13.39,11.11 270 top
U$7  132,41 270 top
U$8  [HEATSINK]  87.12,44 180 top
VOLT_REG  87.1,42.79 0 top
Y1  107.5,19.88 90 top

### Tracks (layer width: path | path; a pad name or v marks a point on that pad's centre or on a via)
3_3V
  Top 0.152: U$1.3V3_LO 49,28.5 50,28.5 56,22.5 63.5,22.5 63.5,16 65.5,14 65.5,12 73.5,4 95.09,4 97.59,6.5 113,6.5 113.01,6.49
  Top 0.25: R14.1 121.65,35.99 HALL1_B.1 HALL2_B.1 | HALL2.1 111.59,34.2 HALL1.1 113.65,36.27 R12.1 113.75,37.1 113.75,38 116.59,40.84 BLUETOOTH.4
  Top 0.254: 3_3V.3 3_3V.2 3_3V.1 114.81,3 112.78,5.03 112.78,6.14 112.75,6.17
  Top 0.305: CAMERA.2 115.18,9.07 113.01,6.49 112.75,6.17
  Bottom 0.25: HALL2.1 111.59,29.41 112.75,28.25 115.25,28.25 115.5,28 115.5,27.15 R13.1 R15.1 121.65,28.52 HALL2_B.1
  Bottom 0.254: R13.1 115.32,26.79 115.32,9.53 CAMERA.2
5V  (via drill 0.6)
  Top 0.152: 5V.3 120.33,6.03 125.09,6.03 125.09,8.57 125,8.57
  Top 0.25: 125,8.42 125,8.57 125,10.75 123.98,11.77 S1.7 125.34,15 v126,15 | 5V.2 5V.1 | v67.25,38.25 v74,38.25 | v76.75,38.25 81.5,38.25 84,35.75 85.33,35.75 C8.1 103.75,37.25 107,40.5 107,42.75 108,43.75 118.63,43.75 SERVO.2 122.66,39.59 125.75,36.5 126.75,36.5 127.5,35.75 v127.5,18
  Top 0.305: C8.1 86.83,39.97 VOLT_REG.2
  Bottom 0.25: REC.2 61.44,32.44 v67.25,38.25 | 5V.3 5V.2 | v74,38.25 v76.75,38.25 | v127.5,18 127.5,16.5 v126,15
5V_TEENSY  (via drill 0.6)
  Top 0.254: 97.39,19.98 100.11,22.7 100.79,22.7 U7.6 101.02,22.7 101.47,22.7 101.92,22.25 101.92,21.34 | 97.39,19.98 97.16,19.75 97.16,17.25 U7.29 | 97.39,19.98 v96.25,21.11 | U7.18 92.16,23.61 v90.8,23.61 88.53,21.34 83.77,21.34 82.18,22.93 v76.73,22.93 | 101.92,21.34 101.7,21.11 101.02,21.11 U7.4 | v111.69,13.85 114.86,13.85 S1.6 | v107.62,15.21 105.33,17.71 105.33,20.2 104.19,21.34 101.92,21.34
  Bottom 0.254: v90.8,23.61 93.75,23.61 v96.25,21.11 | v111.69,13.85 109.19,13.85 v107.62,15.21 | v76.73,22.93 72.19,27.47 46.08,27.47 44.72,28.83 43.81,28.83 U$1.VIN
7_4V
  Top 0.25: R1.2 71.56,24.06 75.25,27.75 75.25,40.5
  Top 0.813: 88.5,43.25 80.25,43.25 80.25,40.5 75.25,40.5 66.88,40.5 66.88,42.9 SV1.6 SV1.5 SV1.4 SV1.3 | 88.5,43.25 97.42,43.25 SV3.1 | VOLT_REG.3 88.5,40.25 88.5,43.25
7_4V_TOP  (via drill 0.6)
  Top 0.305: v1.12,19.25 1.5,19.25 2.38,18.38 3.75,18.38 5.75,20.38 5.75,22.48 C7.1 6.15,23.23 v2.38,26.88
  Top 0.61: 32.75,22 v32.75,24.14 | 32.75,22 32.75,15 33.5,14.25 33.5,11.75 | 28.25,34.75 30.91,34.75 D4.A2 | D4.A1 28.35,29.9 28.25,30 | 33.5,11.75 31.39,11.75 D3.A2 | D3.A1 32.22,7.5 33.5,7.5 33.5,11.75 | v30,22 32.75,22
  Top 1.93: 24.75,38.25 SV5.3 | SV5.3 SV5.4 | SV5.3 SV5.2 SV5.1
  Top 2: TOP_FWD.2 18.74,32.24 24.75,38.25 28.25,34.75 28.25,30 22,23.75 v22,16.75
  Bottom 0.305: GATE2.1 32.27,26.48 31.3,27.45 31.29,29.75 | I_SENSE_AMP.5 1.44,18.93 v1.12,19.25 | v2.38,26.88 2.38,27.25 7.5,32.25 9.53,32.25 9.54,32.24
  Bottom 0.61: 31.29,29.75 D4.A1 | 27.75,24.76 GATE1.1 27.77,22.48 28.25,22 v30,22 | v32.75,24.14 33.38,24.14 GATE2.1
  Bottom 1.27: BIG_SWITCH.GND 9.54,34.46 9.75,34.25
  Bottom 2: TOP_FWD.2 9.54,32.24 9.54,34.46 | TOP_REV.2 23.3,10.95 22,12.25 v22,16.75
7_4V_TOP2  (via drill 0.6)
  Top 0.305: SV7.1 133.54,41.2 133.75,41 145.29,41 LED1_CONN.2 | R6.P$2 141.56,26.23 SV9.2 | LED2_CONN.2 150.09,3.96 144.8,9.25 142.75,9.25 v142.5,9.5
  Bottom 0.305: SV7.1 133.54,31.7 136.5,28.75 141.06,28.75 R6.P$2 | SV9.2 137.96,20.1 R8.P$2 142.5,15.56 v142.5,9.5
ADC6
  Top 0.152: U7.19 92.08,22.54 90.49,22.54 88.79,20.84 85.41,20.84 85.41,9.84 84.77,9.21 ATGPIO.6
  Top 0.254: 92.16,22.7 U7.19
ADC7
  Top 0.152: U7.22 92.08,20.32 87.95,20.32 87.99,12.19 87.83,11.72 87.83,9.41 87.37,8.95 ATGPIO.7
  Top 0.254: 92.16,20.2 U7.22
BATT_VOLTAGE  (via drill 0.8)
  Top 0.813: 15.89,23 15,23
  Top 2: FUSE.A 15.89,23 FUSE.C | 15,23 v13.25,23
  Bottom 2: BATT_HIGH.MP 3.27,22.5 3.25,22.5 3.25,23 v13.25,23
BATT_VOLTAGE_SENSE
  Top 0.25: U$1.17/A3 66.6,28.86 R2.2 R1.1
BLT_RX
  Bottom 0.254: BLUETOOTH.1 108.96,40.86 106.01,40.86 99.43,34.28 83.77,34.28 81.5,34.25 80.5,33.5 80.36,30.87 80.36,23.38 71.96,14.98 67.88,14.98 66.74,13.85 U$1.8
BLT_TX  (via drill 0.6)
  Top 0.254: v76.27,35.19 105.33,35.19 111,40.86 111.46,40.86 BLUETOOTH.2 | v66.29,31.1 67.65,29.74 v67.65,23.84
  Bottom 0.254: v76.27,35.19 70.37,35.19 v66.29,31.1 | v67.65,23.84 67.65,17.48 64.02,13.85 U$1.7
CAMERA_A0  (via drill 0.6)
  Top 0.254: v89.89,5.9 88.76,7.04 88.76,9.99 90.58,11.8 90.58,14.07 88.76,15.89 88.76,19.3 89.21,19.75 90.12,19.75 90.35,19.52 92.16,19.52 U7.23
  Bottom 0.254: v89.89,5.9 90.58,5.9 92.62,3.86 109.42,3.86 112.14,1.14 122.81,1.14 125.76,4.09 125.76,5.9 126.67,6.81 128.48,6.81 129.16,7.49 129.16,8.4 128.03,9.53 124.85,9.53 123.26,11.12 119.4,11.12 117.81,9.53 CAMERA.3
CAMERA_A0_B
  Top 0.152: CAMERA_B.1 103.5,9.53 103.5,9.84 103.45,9.79
  Top 0.25: 103.55,9.69 103.45,9.79 U$1.31/A12
CAMERA_CL  (via drill 0.6)
  Top 0.254: v106.47,24.97 100.11,24.97 99.88,24.74 97.39,24.74 97.16,24.97 97.16,25.65 U7.12 | v111.91,26.79 111.91,24.74 114.41,22.25 116.23,22.25 120.08,18.39 120.08,9.53 CAMERA.4
  Bottom 0.254: v106.47,24.97 108.96,24.97 110.78,26.79 v111.91,26.79
CAMERA_CL_B
  Top 0.152: CAMERA_B.2 100.97,9.53 100.97,9.84 100.91,9.79
  Top 0.25: 101.01,9.69 100.91,9.79 U$1.30
CAMERA_SI
  Top 0.254: U7.11 97.84,25.88 97.84,28.15 98.29,28.6 98.29,33.6 98.97,34.28 105.78,34.28 110.32,29.74 110.32,27.22 111.35,26.02 111.35,22.64 114.41,19.75 116,19.75 119.18,16.57 119.18,8.4 119.86,7.72 120.99,7.72 122.58,9.31 CAMERA.5
CAMERA_SI_B
  Top 0.152: CAMERA_B.3 98.42,9.53 98.42,9.84 98.37,9.79
  Top 0.25: 98.47,9.69 98.37,9.79 U$1.29
EMF_SENSE_HIGH
  Top 0.25: R3.1 59.3,23.49 R4.2 62.01,28.37 U$1.19/A5/SCL
EMF_SENSE_LOW  (via drill 0.6)
  Top 0.254: v111.69,16.12 114.86,16.12 S1.5 | v85.44,22.25 83.54,22.25 81.95,23.84 74.23,23.84 72.19,21.79 64.24,21.79 64.02,22.02 64.02,28.83 U$1.18/A4/SDA
  Bottom 0.254: v111.69,16.12 100.56,16.12 99.43,17.25 99.43,19.75 98.97,20.2 94.89,20.2 92.84,22.25 v85.44,22.25
GND  (via drill 0.6)
  Top 0.25: D1.C D2.C D5.C 42.12,33.02 | 42.12,33.02 U$1.AGND | 42.12,33.02 42.12,15.24 U$1.GND | R2.1 64.8,27.8 65.25,28.25 65.25,30.73 REC.1 | 108.69,9.45 CAMERA.1 | C6.2 106.8,10.76 | 127.5,15.75 124.53,18.72 S1.9 S1.10 S1.11 S1.12 123.98,26.52 122.5,28 | 122.5,28 115,28 114.25,28.75 114.25,30.04 HALL2.2 114.13,34.2 HALL1.2 | 122.5,28 122.5,29.96 HALL2_B.2 HALL1_B.2
  Top 0.254: U7.5 100.79,21.79 100.11,21.79 99.88,21.57 99.88,20.66 100.11,20.43 100.79,20.43 U7.3 101.02,20.43 v102.38,20.43 | U7.21 92.39,21.11 93.07,21.11 93.3,21.34 93.3,24.74 90.35,27.69 80.36,27.69 79.22,28.83 U$1.GND2 | 106.8,10.76 106.8,10.7 108.05,9.45 108.69,9.45 | 127.5,15.75 GROUND.4 | C5.2 105.3,27.06 104.14,25.91 v103.59,26.12
  Top 0.305: GROUND.1 GROUND.2 GROUND.3 GROUND.4 | C8.2 84.92,39.88 VOLT_REG.1
  Bottom 0.25: U$1.AGND 46.2,30.2 46.25,30.25 64,30.25 | 64,30.25 64,31.98 REC.1 69.31,37.34 SV1.7 | 64,30.25 77.91,30.25 U$1.GND2 | HALL1_B.2 122.63,35.13 125.25,37.75 125.25,39.67 SERVO.1 | HALL1.2 114.33,36.32 114.33,40.79 BLUETOOTH.3 113.75,41.37 113.75,42.75 113.5,43 SV3.4
  Bottom 0.254: v102.38,20.43 102.38,24.74 v103.59,26.12 104.65,27.01 C5.2 104.88,27.24 106.92,29.28 106.92,32.01 111.23,36.32 114.33,36.32 114.41,36.32 | CAMERA.1 112.82,9.31 114.41,7.72 127.12,7.72 127.35,7.95 GROUND.3
  Bottom 0.81: SV1.7 SV1.8 SV1.9 SV1.10
  Bottom 0.813: SV1.10 83.25,43 | 83.25,43 96,43 96,41 105.04,41 SV3.4 | VOLT_REG.1 83.25,40.25 83.25,43
GND_TOP  (via drill 0.6, 0.8, 0.8 pad 0.61)
  Top 0.305: C7.2 10.25,22.88 10.5,22.62
  Top 0.4: 9.38,19.37 10.13,18.62 9.47,18.62 MOTOR_NEG_B.MP
  Top 0.61: 10.13,18.62 13.75,15 v27.75,15
  Top 2: C12.- 3.26,39.46 C13.- 3.26,28.74 6.5,25.5 6.5,25.25 10.5,25.25 | C12.- 3.17,40.92 5,42.75 | 3.5,9.5 7.6,13.6 MOTOR_NEG_B.MP 7.6,17.59 9.38,19.37 BATT_LOW.MP 10.5,20.46 10.5,22.62 10.5,25.25 | C14.- 3.25,6.38 v3.25,9.25 3.5,9.5 | BOT_FWD.3 15.39,13.39 11.5,9.5 3.5,9.5 | 10.5,25.25 13.25,25.25 v14.25,26.25 | v19.75,29.25 24.07,29.25 BOT_REV.3 | C12.- v7.12,39.5
  Bottom 0.305: C15.- 3.17,9.17 v3.25,9.25 | I_SENSE_AMP.2 4.62,17.25 6.75,19.38 7.62,19.38 | 7.62,19.38 9.38,19.38 BATT_LOW.MP | R18.1 7.72,19.48 7.62,19.38
  Bottom 0.61: 29,19.38 29,15 v27.75,15 | 29,19.38 GATE1.7 | GATE2.7 35.25,20.25 34.75,20.75 29.75,20.75 29,20 29,19.38 | R16.1 17.9,14.15 BOT_FWD.3
  Bottom 1.93: 29.75,39.5 SV5.5 SV5.6 SV5.7 SV5.8
  Bottom 2: v14.25,26.25 16.75,26.25 v19.75,29.25 | v7.12,39.5 29.75,39.5
GND_TOP2
  Bottom 0.305: U$3.P2 143.17,6.42 147.25,10.5 147.25,15.84 T2.1 T1.1 | SV7.4 141.16,38.82 U$7.P2 142.92,31.58 146.25,28.25 146.25,25.34 T1.1 | T1.1 138.03,25.23 SV9.1
HALL1  (via drill 0.6)
  Top 0.25: R12.2 115.35,35.92 HALL1.3
  Top 0.254: v104.42,19.75 101.24,16.57 99.88,16.57 99.43,17.02 U7.32
  Bottom 0.254: v104.42,19.75 104.42,24.29 106.24,26.11 107.83,26.11 109.19,27.47 109.19,31.78 109.87,32.46 114.86,32.46 116.68,34.28 HALL1.3
HALL1_B  (via drill 0.6)
  Top 0.25: R14.2 123.35,36.24 HALL1_B.3
  Top 0.254: v126.44,37.45 126.44,41.88 122.58,44.72 44.27,44.72 41.09,41.54 41.09,14.76 43.36,12.48 46.54,12.48 47.67,13.62 48.58,13.62 U$1.1/TX
  Bottom 0.254: v126.44,37.45 126.44,35.64 125.31,34.5 HALL1_B.3
HALL2  (via drill 0.6)
  Top 0.254: v102.38,19.07 101.92,19.07 101.7,18.84 101.02,18.84 U7.1 | v110.1,31.33 110.1,35.19 112.59,37.68 112.59,41.77 113.73,42.9 116.91,42.9 118.04,41.77 118.04,33.14 116.68,31.78 116.68,30.19 HALL2.3
  Bottom 0.254: v102.38,19.07 102.61,18.84 107.37,18.84 113.73,25.2 113.73,26.79 R13.2 113.5,27.01 112.82,27.69 111.69,27.69 110.1,29.28 v110.1,31.33
HALL2_B  (via drill 0.6)
  Top 0.254: v118.27,14.76 114.18,10.67 114.18,8.85 113.05,7.72 104.58,7.72 103.96,7.1 103.21,7.11 97.3,7.11 94.89,4.54 73.85,4.54 v67.22,11.58
  Bottom 0.254: HALL2_B.3 125.08,29.96 123.49,28.38 123.49,27.01 R15.2 123.26,26.79 118.27,21.79 v118.27,14.76 | v67.22,11.58 61.97,11.58 60.16,13.39 60.16,14.07 59.25,14.98 53.57,14.98 52.44,13.85 51.3,13.85 U$1.2
HI
  Top 0.25: U$1.3/CANTX 53.82,7.93 57,4.75 57,2.39 SV2.2
HI_TOP  (via drill 0.6, 0.6 pad 0.61)
  Top 0.305: v38,28.75 34.88,28.75 28.62,22.5 28.62,20.62 v31.5,17.75 | 22.36,7 SV6.2
  Top 0.4: v31.5,17.75 31.5,15.25 26.25,10 26.25,8 25.25,7 22.36,7
  Bottom 0.305: GATE2.6 36.52,20.77 38.62,22.75 38.62,28.25 v38,28.75
  Bottom 0.4: GATE1.5 31.59,17.84 v31.5,17.75
I_SENSE
  Top 0.254: SV2.3 58.9,2.25 U$1.5
I_SENSE_HI_TOP
  Bottom 0.305: R17.1 14.22,20.09 12.38,18.62 6.88,18.62 5.38,17.12 5.38,16.38 5.25,16.25 4.11,16.25 I_SENSE_AMP.3
  Bottom 2: R17.1 16.12,21.87 22,27.75 22,32.12 | 22,32.12 24.4,32.12 BOT_REV.2 | 17.11,34.92 TOP_FWD.3 19.34,34.78 22,32.12
I_SENSE_LOW_TOP
  Bottom 0.305: I_SENSE_AMP.4 1.44,15.68 MOTOR_POS.MP | 7.5,13.12 9,13.12 17.75,4.38 19.38,4.38 SV6.4
  Bottom 2: R17.2 10.51,16.13 7.5,13.12 4,13.12 MOTOR_POS.MP 3.65,13.75
I_SENSE_TOP  (via drill 0.6)
  Top 0.305: v5.62,15.38 2.5,15.38 1.62,14.5 1.62,12 v2.38,11.25
  Bottom 0.305: R18.2 6.03,20.17 I_SENSE_AMP.1 3.2,18.2 2.88,17.88 2.88,15.5 3,15.38 v5.62,15.38 | v2.38,11.25 3.25,11.25 7.25,7.25 7.25,4.88 8.2,3.78 18.2,3.78 SV6.3
LED1
  Top 0.25: R9.2 62.08,41 U$1.14/A0
LED1HI
  Top 0.152: LED1.POSITIVE1 160.02,38.1 LED1.POSITIVE
  Top 0.406: LED1.POSITIVE LED1.POSITIVE1 158.8,37.98 158.8,32.73 158.84,28.23 LED1_CONN2.2
LED1LO
  Top 0.152: LED1.NEGATIVE1 163.51,38.1 LED1.NEGATIVE1
  Top 0.406: LED1.NEGATIVE LED1.NEGATIVE1 164.8,37.98 164.8,32.73 164.78,28.33 LED1_CONN2.1
LED2
  Top 0.25: R10.2 61.79,38.75 U$1.15/A1
LED2HI
  Top 0.152: LED2.POSITIVE 162.88,7.94 163.19,7.94 LED2.POSITIVE1
  Top 0.406: LED2_CONN2.2 164.5,17.38 164.5,7.5 163.22,7.5 LED2.POSITIVE1
LED2LO
  Top 0.152: LED2.NEGATIVE 159.7,7.94 LED2.NEGATIVE1
  Top 0.406: LED2_CONN2.1 158.5,17.38 158.5,7.5 159.53,7.5 LED2.NEGATIVE1
LED3
  Top 0.25: U$1.16/A2 69,29 69,29.75 62.5,36.25 R11.2
LI
  Bottom 0.25: U$1.4/CANRX 56.36,7.86 54,5.5 54,2.07 SV2.1
LI_TOP  (via drill 0.6, 0.6 pad 0.61)
  Top 0.152: SV6.1 14.61,2.22 14.61,2.54 14.63,2.51
  Top 0.4: v30.25,16.75 30.25,15 27.5,12.25 v27.12,12.25
  Top 0.406: 14.57,2.44 14.63,2.51 16.62,4.5 17.25,4.5 18.12,5.38 v18.75,5.38 | v25.75,4.25 v28.88,4.25
  Bottom 0.305: GATE2.5 38.85,18.62 38.8,14.1 38.8,1.58 38.18,0.95 30.59,0.95 28.8,2.74 28.8,4.18 v28.88,4.25 28.8,4.32 28.8,6.1 27.13,7.77 27.12,7.77 | 27.12,7.75 27.12,7.77 | 27.12,7.77 v27.12,12.25
  Bottom 0.4: GATE1.6 30.32,16.82 v30.25,16.75
  Bottom 0.406: v18.75,5.38 19.88,5.38 21,4.25 v25.75,4.25
MOTOR_HIGH
  Top 0.25: 60.25,12.75 60.25,20.74 R3.2
  Top 0.254: 60.25,12.75 60.2,12.75 60.2,3.48 SV2.4
MOTOR_LOW  (via drill 0.6)
  Top 0.25: R4.1 62.01,15.24 62.75,14.5 62.75,9.5
  Top 0.254: v122.58,14.98 122.81,14.98 123.94,16.12 S1.8 | v109.8,2.05 109.32,2.05 107.06,4.46 96.48,4.46 95.34,3.33 65.91,3.33 SV2.5 62.75,3.47 62.75,9.5
  Bottom 0.254: v122.58,14.98 123.49,14.98 126.89,11.58 128.71,11.58 129.82,10.67 129.82,5.45 128.26,4.09 126.44,4.09 123.08,0.58 111.21,0.58 v109.8,2.05
MOTOR_LOW_TOP
  Bottom 0.305: TOP_REV.3 27.43,5.59 27.43,4.06 26.42,3.3 24.89,3.3 24.73,3.14 24.74,3.14 SV6.5
  Bottom 2: MOTOR_NEG.MP 11.51,12.99 13.75,10.75 17.04,10.75 BOT_FWD.2 19.15,10.85 21.5,8.5 24.52,8.5 TOP_REV.3
N$1
  Top 0.305: U$7.P3 148,33.92 R5.1
N$2  (via drill 0.6)
  Top 0.61: v28.75,27.75 27.75,26.75 v27.75,21
  Bottom 0.61: GATE1.8 27.77,20.73 v27.75,21 | v28.75,27.75 26.25,27.75 26.25,33.09 BOT_REV.1
N$3  (via drill 0.6)
  Top 0.61: TOP_FWD.1 16.97,29.53 20.25,26.25 v20.25,23
  Bottom 0.305: 30.33,24.75 GATE1.3
  Bottom 0.61: v20.25,23 21.5,23 25,26.2 29.74,26.2 30.33,25.6 30.33,24.75
N$4  (via drill 0.6)
  Top 0.305: v37.19,22.67 37.19,22.49 37.17,22.12 v37.25,13.69
  Bottom 0.305: C2.1 37,6.39 C1.1 34.9,7.96 34.9,8.38 37.25,10.73 v37.25,13.69
  Bottom 0.61: GATE1.4 31.59,23.41 32,23 36.58,23.01 36.59,23 v37.19,22.67
N$5  (via drill 0.6)
  Top 0.61: v34.75,21.88 v34.75,13.97
  Bottom 0.305: 33.83,9 C1.2 v34.75,13.97 | C2.2 32.68,2.65 33.83,3.81 33.83,6.51 33.8,6.54
  Bottom 0.61: 33.8,6.54 33.83,9 33.67,9.16 D3.C | GATE1.2 29.05,23.7 29.5,23.25 30.25,23.25 31.75,21.88 v34.75,21.88
N$6
  Top 0.25: C6.1 108.7,16.18 Y1.1 107.52,18.98 103,23.5 100.89,23.5 U7.7
N$7
  Top 0.25: C5.1 107.52,27.01 Y1.2 105.06,22.44 103.25,24.25 100.9,24.25 U7.8
N$8
  Top 0.254: LED_DRIVER2.3 140.29,32.46 143.92,32.46 R5.2
  Top 0.305: T1.2 149.73,25.23 150.75,26.25 150.75,28.25 149.25,29.75 146.57,29.75 R5.2
N$9  (via drill 0.6)
  Top 0.4: v25.25,6 29,6 30.25,4.75 36,4.75 36,9.75 v37.8,9.7
  Bottom 0.305: 34,19.4 34,17.96 38.16,16.54 38.16,12.92 v37.8,9.7
  Bottom 0.4: BOT_FWD.1 18.69,8.31 21,6 v25.25,6 | 34,19.4 GATE2.8
N$10  (via drill 0.6)
  Top 0.61: v36.5,26.3 36.5,24 36,23.5 v36,16.16
  Bottom 0.305: 35.97,16.19 v36,16.16
  Bottom 0.61: GATE2.3 36.52,26.48 v36.5,26.3 | TOP_REV.1 32.23,13.49 33.71,16.19 35.97,16.19
N$11
  Bottom 0.305: 36.58,29.11 37.64,30.18 37.64,34.67 C4.1 | 36.78,27.83 37.8,26.82 37.8,24.74
  Bottom 0.61: 36.58,29.11 36.58,27.83 C3.1 36.78,27.83 | 37.8,24.74 GATE2.4
N$12
  Bottom 0.305: 34.04,32.86 C3.2 34.33,29.85 34.29,26.36 35.24,25.56 GATE2.2 | 34.04,32.86 34.04,38.72 C4.2 | 34.04,32.86 31.33,32.71
  Bottom 0.61: 31.33,32.71 D4.C
N$13
  Top 0.305: U$3.P3 148.25,10.45 R7.1
N$16
  Top 0.305: R6.P$1 133.94,31.14 LED_DRIVER2.1 137.79,29.75 143,29.75 144.98,27.77 T1.3
N$17
  Top 0.305: LED_DRIVER2.2 137.71,35.46 142.5,40.25 146,40.25 146.75,41 147.83,41 LED1_CONN.1
N$18
  Top 0.305: T2.2 144.7,12.54 R7.2 LED_DRIVER1.3
N$19
  Top 0.305: T2.3 136.96,19.27 R8.P$1 135.29,15.14 LED_DRIVER1.1
N$20
  Top 0.305: LED_DRIVER1.2 137.84,10.66 141.75,6.75 146.25,6.75 147.5,5.5 147.5,2.04 LED2_CONN.1
N$21  (via drill 0.6, 0.6 pad 0.61, 0.8)
  Top 0.61: C14.+ v14.25,6.25 17.25,6.25 19.5,8.5 v19.5,12.75
  Top 2: C12.+ 11.17,29.2 C13.+ | C13.+ 7.36,29.11 v7.25,29 | C13.+ 14.64,29.11 18.25,25.5 18.25,20.25 v19.5,20.25 | FUSE.D 25.75,17.59 v25.75,20.25 25.81,20.31 FUSE.B
  Bottom 0.305: C15.+ 14.15,6.35 v14.25,6.25
  Bottom 0.61: v19.5,12.75 19.5,17.15 R16.2 19.6,20.15 v19.5,20.25
  Bottom 1.016: BIG_SWITCH.VCC 7.25,26.25
  Bottom 2: 7.25,26.25 v7.25,29 | v19.5,20.25 v25.75,20.25
N$22
  Top 0.25: R9.1 D1.A
N$23
  Top 0.25: D2.A R10.1
N$24
  Top 0.25: R11.1 D5.A
N$25
  pour Bottom: 50.9,46.79 50.9,72.19 76.3,72.19 76.3,46.79
PB1  (via drill 0.38)  (1 unrouted)
  Top 0.152: v95.23,19.35 95.25,21.27 96.2,22.23 96.2,25.72 U7.13
  Top 0.254: 96.02,25.65 U7.13
  Bottom 0.152: v95.23,19.35 95.25,18.41 90.49,14.06 90.49,13.34 89.22,12.06 86.68,12.06 86.04,11.43 86.04,7.26 | ATGPIO.10 94.61,8.89 93.03,7.3 93.03,7.26
  Bottom 0.254: 76.05,7.95 76.73,7.26 86.04,7.26 93.03,7.26
PC1  (via drill 0.38, 0.6)
  Top 0.152: v76.5,15.21 76.2,14.92 72.71,14.92 72.71,9.84 72.07,9.21 ATGPIO.1 | v89.53,18.41 92.08,18.41 U7.24
  Top 0.254: 92.16,18.84 U7.24
  Bottom 0.152: v89.53,18.41 82,18.01 78.63,15.24 76.52,15.24 v76.5,15.21
PC2  (via drill 0.38)
  Top 0.152: v89.53,17.35 90.75,17.55 91.64,17.27 93.66,17.14 U7.25
  Top 0.254: 93.75,17.25 U7.25
  Bottom 0.152: v89.53,17.35 82.55,17.14 74.61,9.21 ATGPIO.2
PC3  (via drill 0.38)
  Top 0.152: v90.65,16.65 90.86,16.3 94.41,16.22 94.5,16.83 94.61,17.14 U7.26
  Top 0.254: 94.43,17.93 94.43,17.25 U7.26
  Bottom 0.152: v90.65,16.65 82.78,16.51 77.15,10.88 77.15,9.21 ATGPIO.3
PC4  (via drill 0.38)
  Top 0.152: v89.85,15.88 94.61,15.81 95.25,16.51 95.25,17.14 U7.27
  Top 0.254: 95.34,17.02 U7.27
  Bottom 0.152: v89.85,15.88 84.68,15.88 82.87,14.06 82.87,12.38 79.69,9.21 ATGPIO.4
PC5  (via drill 0.38)
  Top 0.152: v93.87,18.62 95.77,18.62 96.2,17.78 96.2,17.46 U7.28
  Bottom 0.152: v93.87,18.62 90.17,14.92 86.27,14.92 85.41,14.06 85.41,12.38 82.23,9.21 ATGPIO.5
PD4  (via drill 0.38)
  Top 0.152: v98.34,19.37 100.65,19.37 U7.2 | v94.38,15.08 93.23,14.26 93.23,12.38 89.85,9.21 ATGPIO.8
  Top 0.254: 100.79,19.3 U7.2
  Bottom 0.152: v94.38,15.08 v98.34,19.37
PD5  (via drill 0.6)  (1 unrouted)
  Top 0.152: 83.31,9.99 83.31,7.04 84.9,5.45
  Top 0.254: v98.75,27.24 99.2,26.79 99.2,25.88 U7.9 | v80.59,19.3 80.59,12.71 83.31,9.99 | v88.08,5.45 84.9,5.45
  Bottom 0.152: ATGPIO.9 92.39,9.21 93.03,9.21 94.61,10.79 95.25,10.79 95.89,10.16 95.89,7.53 95,6.84 89.45,6.83 89.26,6.63
  Bottom 0.254: v98.75,27.24 95.07,27.24 92.8,25.38 85.92,25.38 83.26,22.93 83.26,20.88 81.27,19.3 v80.59,19.3 | 89.26,6.63 v88.08,5.45
REC_EXTRA1
  Top 0.254: REC.5 53.8,31.78 53.8,29.06 U$1.22/A8
REC_EXTRA2
  Top 0.254: REC.6 51.3,31.78 51.3,29.06 U$1.23/A9
REC_MOTOR
  Top 0.254: REC.4 56.52,31.78 56.52,29.06 U$1.21/A7
REC_SERVO
  Top 0.254: REC.3 59.02,31.78 59.02,29.06 U$1.20/A6
RX  (via drill 0.6)
  Top 0.254: v100.56,17.48 99.88,18.16 98.07,18.16 97.84,17.93 97.84,17.25 U7.30
  Bottom 0.254: v100.56,17.48 100.56,24.29 105.33,29.06 105.33,29.96 TXRX.1
SERVO
  Bottom 0.254: U$1.9/CS 69.01,13.62 68.1,13.62 66.97,12.48 63.56,12.48 62.65,13.39 62.65,14.07 51.53,25.2 45.86,25.2 42.45,28.6 42.45,29.28 55.62,42.45 55.62,44.27 56.07,44.72 115.32,44.72 120.08,39.95 SERVO.3
SPI_MISO  (via drill 0.6)
  Top 0.254: v92.84,26.79 93.75,25.88 U7.16
  Bottom 0.254: v92.84,26.79 86.44,26.79 82.61,23.15 82.61,21.11 81.5,20.2 79.45,20.2 74.23,14.98 74.23,13.85 U$1.11/MOSI
SPI_MOSI  (via drill 0.6)
  Top 0.254: v78.09,25.42 78.09,29.5 | 78.09,29.5 78.09,29.51 | v77.41,21.79 77.41,14.53 76.73,13.85 U$1.12/MISO | U7.15 94.43,25.88 94.43,26.56 93.3,27.69 91.48,27.69 90.58,28.6 90.58,33.6 89.89,34.28 82.86,34.28 80.75,34.25 78.25,32.5 78.09,29.5
  Bottom 0.254: v78.09,25.42 78.09,22.47 v77.41,21.79
SPI_SCK
  Top 0.25: U$1.13/SCK 76.68,25.57 77.75,24.5 92.07,24.5 U7.17
SPI_SS  (via drill 0.6)
  Top 0.254: v94.66,24.29 95.34,24.97 95.34,25.65 U7.14
  Bottom 0.254: v94.66,24.29 91.48,24.29 91.26,24.52 85.94,24.52 83.92,22.7 83.92,20.66 78.77,16.12 76.05,16.12 75.37,15.44 75.37,13.39 74.46,12.48 72.87,12.48 71.73,13.62 U$1.10/CS
SW1  (via drill 0.6)
  Top 0.254: v112.82,25.65 113.5,26.33 114.86,26.33 S1.1 | v109.87,24.52 109.87,26.11 107.83,28.15 104.42,28.15 v103.74,28.83 | v81.5,21.57 81.5,14.07 81.72,13.85 U$1.24
  Bottom 0.254: v112.82,25.65 111,25.65 v109.87,24.52 | v103.74,28.83 102.38,30.19 88.99,30.19 88.08,29.28 85.81,27.24 81.5,22.93 v81.5,21.57
SW2  (via drill 0.6)
  Top 0.152: v85.35,6.36 83.78,7.22 83.77,13.17
  Top 0.25: 96.93,3.86 96.78,3.86 v96.13,2.75
  Top 0.254: 96.93,3.86 106.23,3.86 108.95,1.14 122.81,1.14 125.53,3.86 125.53,13.39 126.21,14.07 126.67,14.07 126.89,14.3 126.89,15.66 125.31,17.25 123.26,17.25 116.91,23.61 115.09,23.61 S1.2 | 83.77,13.17 84.22,13.62 U$1.25
  Bottom 0.254: v85.35,6.36 88.96,2.75 v96.13,2.75
SW3  (via drill 0.6)
  Top 0.254: v116.68,20.43 116,21.11 115.09,21.11 S1.3 | v116.68,15.44 116,14.76 v113.5,14.76 | v86.94,11.12 86.94,13.62 U$1.26
  Bottom 0.254: v116.68,15.44 v116.68,20.43 | v113.5,14.76 113.5,14.3 110.55,11.35 87.17,11.35 v86.94,11.12
SW4  (via drill 0.6)
  Top 0.152: 88.31,6.81 88.31,11.58 89.21,12.48 89.21,13.62
  Top 0.254: v113.73,17.48 114.86,18.61 S1.4 | v91.94,5.9 91.26,5.9 90.34,5.04 89.43,5.04 88.99,5.45 88.99,6.13 88.31,6.81 | 89.21,13.62 U$1.27
  Bottom 0.254: v113.73,17.48 113.73,15.89 114.41,15.21 114.41,13.49 109.74,8.83 109.13,8.25 106.64,5.75 v91.94,5.9
THERM1  (via drill 0.38 pad 0.01)
  other vias: 161.34,40.25 161.98,40.25 161.34,39.61 161.98,39.61 161.34,38.98 161.98,38.98 161.34,38.34 161.98,38.34 161.34,37.71 161.98,37.71 161.34,37.07 161.98,37.07 161.34,36.44 161.98,36.44 161.34,35.8 161.98,35.8
  pour Bottom: 153.5,45 169.5,45 169.5,31 153.5,31
  pour Top: 153.5,45 153.5,31 169.5,31 169.5,45
THERM2  (via drill 0.38 pad 0.05)
  other vias: 161.04,7.42 161.68,7.42 161.04,6.79 161.68,6.79 161.04,6.16 161.68,6.16 161.04,5.52 161.68,5.52 161.04,8.06 161.68,8.06 161.04,8.7 161.68,8.7 161.04,9.33 161.68,9.33 161.04,9.96 161.69,9.96
  pour Top: 153.5,15 153.5,0.5 169.5,0.5 169.5,15
  pour Bottom: 153.5,15 169.5,15 169.5,0.5 153.5,0.5
TX
  Top 0.254: U7.31 98.75,17.02 98.75,16.34 100.11,14.98 105.56,14.98 107.6,13.7 107.6,11.89 107.59,11.89 108.2,11.28 109.42,11.28 110.8,12.65 110.8,13.38 110.78,13.39 110.78,25.88 108.05,28.6 108.05,29.96 TXRX.2

### Text on the board
tPlace: POWER | POWER | LM1086 | RX | TX | GND | 3.3 | D1 | SIG | 5V | GND | R9 | 7.4V | GND | 7.4V | GND | 7.4 | NC | NC | BLT | D2 | GND | SVO | R10 | D3 | R11 | C8 | A9 | A8 | MOTOR | SERVO | 5V | GND | C4 | HL1 | HL1B | A22 | A21 | A14 | 3.3 | GND | OUT | 3.3 | GND | OUT | REC | A20 | A19 | A18 | A17 | A16 | A15 | RX | TX | TGPIO | C3 | HL2 | HL2B | R6 | GND | T1 | C5 | GND | R3 | R4 | R2 | R1 | ATMEGA / 328P | C7 | GND | GND | 7.4 | FUSE | Y1 | GND | T2 | R8 | 5V | C6 | R7 | PD4 | PB1 | GND | 3.3 | A0 | CLK | SI | GND | C1 | ADC6 | CAM.B | CAM | ATGPIO | ACD7 | PD5 | SI | CLK | A0 | 3.3 | GND | C2 | PC1 | PC2 | PC3 | PC4 | PC5 | 5V | 5V | NC | PWR | 3.3V | 3.3V | GND